# EAGLE schematic psion (EAGLE 9.5.0)

## Sheet 1 of 5
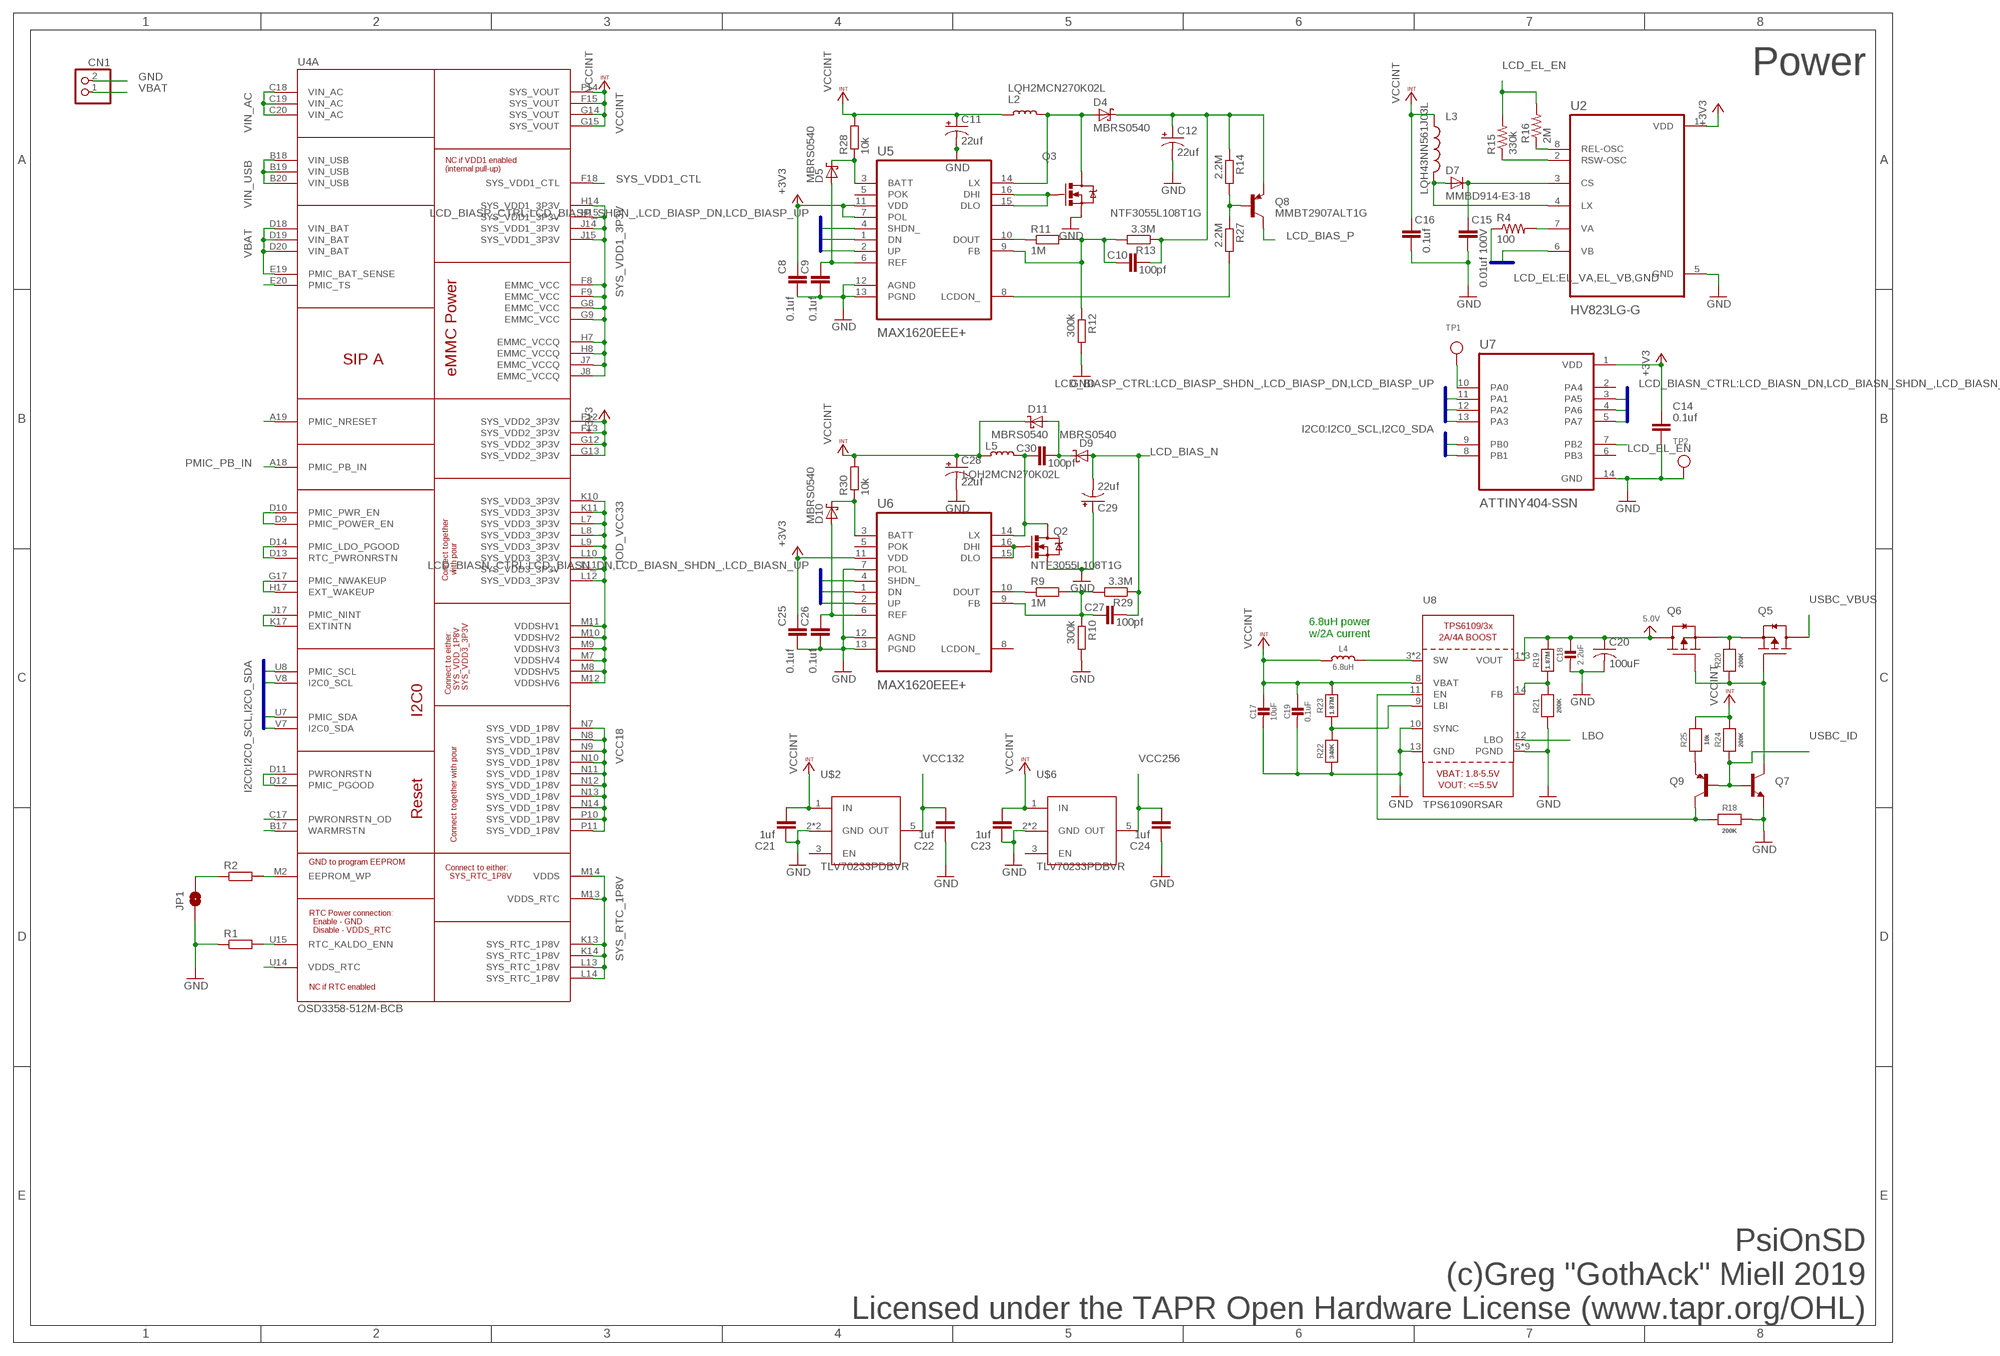
[diagram p0: schematic, sheet 1]

### Parts
C8  0.1uf  CAPACITOR_NPOL-0805  [C805]
C9  0.1uf  CAPACITOR_NPOL-0805  [C805]
C10  100pf  CAPACITOR_NPOL-0805  [C805]
C11  22uf  CPOL-USKEMET_C_2312  [CAPCP6032X280N]
C12  22uf  CPOL-USKEMET_C_2312  [CAPCP6032X280N]
C14  0.1uf  CAPACITOR_NPOL-0805  [C805]
C15  0.01uf 100V  CAPACITOR_NPOL-0805  [C805]
C16  0.1uf  CAPACITOR_NPOL-0805  [C805]
C17  10uF  CAP_CERAMIC0805  [0805]
C18  2.2uF  CAP_CERAMIC0805  [0805]
C19  0.1uF  CAP_CERAMIC0805  [0805]
C20  100uF  C-USC1210  [C1210]
C21  1uf  CAPACITOR_NPOL-0805  [C805]
C22  1uf  CAPACITOR_NPOL-0805  [C805]
C23  1uf  CAPACITOR_NPOL-0805  [C805]
C24  1uf  CAPACITOR_NPOL-0805  [C805]
C25  0.1uf  CAPACITOR_NPOL-0805  [C805]
C26  0.1uf  CAPACITOR_NPOL-0805  [C805]
C27  100pf  CAPACITOR_NPOL-0805  [C805]
C28  22uf  CPOL-USKEMET_C_2312  [CAPCP6032X280N]
C29  22uf  CPOL-USKEMET_C_2312  [CAPCP6032X280N]
C30  100pf  CAPACITOR_NPOL-0805  [C805]
CN1  JST_2PIN-SMT-RA  [JST-PH-2-SMT-RA]
D4  MBRS0540  SCHOTTKY_SOD-123  [SOD3718X135N]
D5  MBRS0540  SCHOTTKY_SOD-123  [SOD3718X135N]
D7  MMBD914-E3-18  DIODE_SOT-23  [SOT95P280X135-3N]
D9  MBRS0540  SCHOTTKY_SOD-123  [SOD3718X135N]
D10  MBRS0540  SCHOTTKY_SOD-123  [SOD3718X135N]
D11  MBRS0540  SCHOTTKY_SOD-123  [SOD3718X135N]
JP1  JUMPER-SMT_2_NO_NO-SILK  [SMT-JUMPER_2_NO_NO-SILK]
L2  LQH2MCN270K02L  INDUCTOR  [INDUCTOR_1007]
L3  LQH43NN561J03L  [IND_LQH43CN1R0M03L]
L4  6.8uH  INDUCTORTDK_VLC5045  [INDUCTOR_5X5MM_TDK_VLC5045]
L5  LQH2MCN270K02L  INDUCTOR  [INDUCTOR_1007]
Q2  NTF3055L108T1G  MOSFET-NCHANNELSMD  [SOT23-3]
Q3  NTF3055L108T1G  MOSFET-NCHANNELSMD  [SOT23-3]
Q5  MOSFET-PCH_SOT-223  [SOT230P700X160-4N]
Q6  MOSFET-PCH_SOT-223  [SOT230P700X160-4N]
Q7  NPN_SOT-323  [SOT65P210X110-3N]
Q8  MMBT2907ALT1G  PNP_SOT-23  [SOT95P280X135-3N]
Q9  PNP_SOT-323  [SOT65P210X110-3N]
R1  R-EU_R0805  [R0805]
R2  R-EU_R0805  [R0805]
R4  100  R-US_M0805  [M0805]
R9  1M  R-EU_R0805  [R0805]
R10  300k  R-EU_R0805  [R0805]
R11  1M  R-EU_R0805  [R0805]
R12  300k  R-EU_R0805  [R0805]
R13  3.3M  R-EU_R0805  [R0805]
R14  2.2M  R-EU_R0805  [R0805]
R15  330k  R-US_M0805  [M0805]
R16  2M  R-US_M0805  [M0805]
R18  200K  RESISTOR0805  [0805]
R19  1.87M  RESISTOR0805  [0805]
R20  200K  RESISTOR0805  [0805]
R21  200K  RESISTOR0805  [0805]
R22  340K  RESISTOR_0805MP  [_0805MP]
R23  1.87M  RESISTOR_0805MP  [_0805MP]
R24  200K  RESISTOR0805  [0805]
R25  10k  RESISTOR0805  [0805]
R27  2.2M  R-EU_R0805  [R0805]
R28  10k  R-EU_R0805  [R0805]
R29  3.3M  R-EU_R0805  [R0805]
R30  10k  R-EU_R0805  [R0805]
TP1  TESTPOINTROUND1MM  [TESTPOINT_ROUND_1MM]
TP2  TESTPOINTROUND1MM  [TESTPOINT_ROUND_1MM]
U2  HV823LG-G  [SOIC127P600X175-8N]
U4  OSD3358-512M-BCB  [OSD335X-BGA-400]
U5  MAX1620EEE+  [SOP63P602X175-16N]
U6  MAX1620EEE+  [SOP63P602X175-16N]
U7  ATTINY404-SSN  [SOIC127P600X175-14N]
U8  TPS61090RSAR  VREG_TPS6103X  [PVQFN-16]
U$2  TLV70233PDBVR  [SOT23-5]
U$6  TLV70233PDBVR  [SOT23-5]

### Nets
5.0V: C18.1 C20.1 Q6.4(D) R19.2 U8.1(VOUT) U8.15(VOUT) U8.16(VOUT)
+3V3 [power]: C8.1 C14.1 C25.1 U2.1(VDD) U4.F12(A:SYS_VDD2_3P3V) U4.F13(A:SYS_VDD2_3P3V) U4.G12(A:SYS_VDD2_3P3V) U4.G13(A:SYS_VDD2_3P3V) U5.7(POL) U5.11(VDD) U6.11(VDD) U7.1(VDD) ; also sheet 2,3
BOOST_EN: Q9.3(C) R18.1 U8.11(EN)
EL_VA [power]: R4.1 ; also sheet 3
EL_VA_PRE [power]: R4.2 U2.7(VA)
EL_VB [power]: U2.6(VB) ; also sheet 3
GND [power]: C8.2 C9.2 C11.N(-) C12.N(-) C14.2 C15.2 C16.2 C17.2 C18.2 C19.2 C20.2 C21.1 C22.1 C23.1 C24.1 C25.2 C26.2 C28.N(-) C29.P(+) CN1.2 JP1.1 Q2.2(S) Q3.2(S) Q7.2(E) R1.1 R10.2 R12.2 R18.2 R21.1 R22.1 TP2.P$1 U2.5(GND) U5.12(AGND) U5.13(PGND) U6.7(POL) U6.12(AGND) U6.13(PGND) U7.14(GND) U8.5(PGND) U8.6(PGND) U8.7(PGND) U8.10(SYNC) U8.13(GND) U8.P$18(PGND) U8.P$19(PGND) U8.P$20(PGND) U8.P$21(PGND) U8.P$22(PGND) U8.THERMAL(PGND) U$2.2(GND) U$2.4(GND) U$6.2(GND) U$6.4(GND) ; also sheet 2,3,4
I2C0_SCL [data]: U4.U8(A:PMIC_SCL) U4.V8(A:I2C0_SCL) U7.9(PB0) ; also sheet 2
I2C0_SDA [data]: U4.U7(A:PMIC_SDA) U4.V7(A:I2C0_SDA) U7.8(PB1) ; also sheet 2
IOD_VCC33 [power]: U4.K10(A:SYS_VDD3_3P3V) U4.K11(A:SYS_VDD3_3P3V) U4.L7(A:SYS_VDD3_3P3V) U4.L8(A:SYS_VDD3_3P3V) U4.L9(A:SYS_VDD3_3P3V) U4.L10(A:SYS_VDD3_3P3V) U4.L11(A:SYS_VDD3_3P3V) U4.L12(A:SYS_VDD3_3P3V) U4.M7(A:VDDSHV4) U4.M8(A:VDDSHV5) U4.M9(A:VDDSHV3) U4.M10(A:VDDSHV2) U4.M11(A:VDDSHV1) U4.M12(A:VDDSHV6)
LBO: U8.12(LBO)
LCD_BIAS_N [power]: C27.2 C29.N(-) D9.A R29.1 ; also sheet 3
LCD_BIAS_N_P1 [power]: C30.1 L5.P$2 Q2.3(D) U6.14(LX)
LCD_BIAS_N_P2 [power]: C30.2 D9.K D11.A
LCD_BIAS_P [power]: Q8.3(C) ; also sheet 3
LCD_BIAS_P_P1 [power]: D4.A L2.P$2 Q3.3(D) U5.14(LX)
LCD_BIAS_P_P2 [power]: C10.2 C12.P(+) D4.K Q8.2(E) R13.1 R14.1
LCD_BIASN_SHDN_: U6.4(SHDN_) U7.5(PA7)
LCD_BIASN_UP: U6.2(UP) U7.4(PA6)
LCD_BIASND_N: U6.1(DN) U7.3(PA5)
LCD_BIASP_SHDN_: U5.4(SHDN_) U7.13(PA3)
LCD_BIASP_UP: U5.2(UP) U7.11(PA1)
LCD_BIASPD_N: U5.1(DN) U7.12(PA2)
LCD_EL_EN: R15.2 R16.2 U7.7(PB2)
N$1: D7.1(A) L3.2 U2.4(LX)
N$3: C15.1 D7.3(K) U2.3(CS)
N$5: R2.2 U4.M2(A:EEPROM_WP)
N$7: U4.D9(A:PMIC_POWER_EN) U4.D10(A:PMIC_PWR_EN)
N$8: U4.D13(A:RTC_PWRONRSTN) U4.D14(A:PMIC_LDO_PGOOD)
N$9: U4.J17(A:PMIC_NINT) U4.K17(A:EXTINTN)
N$10: U4.G17(A:PMIC_NWAKEUP) U4.H17(A:EXT_WAKEUP)
N$11: U4.D11(A:PWRONRSTN) U4.D12(A:PMIC_PGOOD)
N$12: JP1.2 R2.1
N$16: Q3.1(G) U5.15(DLO) U5.16(DHI)
N$23: Q2.1(G) U6.15(DLO) U6.16(DHI)
N$25: R11.1 U5.10(DOUT)
N$26: C10.1 R11.2 R12.1 R13.2 U5.9(FB)
N$28: Q8.1(B) R14.2 R27.1
N$29: TP1.P$1 U7.10(PA0)
N$32: R27.2 U5.8(LCDON_)
N$33: R15.1 U2.2(RSW-OSC)
N$34: R16.1 U2.8(REL-OSC)
N$37: R22.2 R23.1 U8.9(LBI)
N$39: R19.1 R21.2 U8.14(FB)
N$42: Q5.1(G) Q6.1(G) Q7.3(C) R20.1
N$44: Q9.2(E) R25.1
N$45: D5.K R28.1 U5.3(BATT)
N$46: C9.1 D5.A U5.6(REF)
N$47: R9.1 U6.10(DOUT)
N$48: C27.1 R9.2 R10.1 R29.2 U6.9(FB)
N$49: D10.K R30.1 U6.3(BATT)
N$50: C26.1 D10.A U6.6(REF)
PMIC_NRESET: U4.A19(A:PMIC_NRESET)
PMIC_PB_IN [data]: U4.A18(A:PMIC_PB_IN) ; also sheet 2
PMIC_TS: U4.E20(A:PMIC_TS)
PWRONRSTN_OD: U4.C17(A:PWRONRSTN_OD)
ROPU: R1.2 U4.U15(A:RTC_KALDO_ENN)
SYS_RTC_1P8V [power]: U4.K13(A:SYS_RTC_1P8V) U4.K14(A:SYS_RTC_1P8V) U4.L13(A:SYS_RTC_1P8V) U4.L14(A:SYS_RTC_1P8V) U4.M13(A:VDDS_RTC) U4.M14(A:VDDS)
SYS_VDD1_3P3V [power]: U4.F8(A:EMMC_VCC) U4.F9(A:EMMC_VCC) U4.G8(A:EMMC_VCC) U4.G9(A:EMMC_VCC) U4.H7(A:EMMC_VCCQ) U4.H8(A:EMMC_VCCQ) U4.H14(A:SYS_VDD1_3P3V) U4.H15(A:SYS_VDD1_3P3V) U4.J7(A:EMMC_VCCQ) U4.J8(A:EMMC_VCCQ) U4.J14(A:SYS_VDD1_3P3V) U4.J15(A:SYS_VDD1_3P3V)
SYS_VDD1_CTL: U4.F18(A:SYS_VDD1_CTL)
USBC_ID: Q7.1(B) Q9.1(B) R24.1 ; also sheet 2
USBC_IND_SW [power]: L4.P$2 U8.3(SW) U8.4(SW)
USBC_VBUS [power]: Q5.4(D) ; also sheet 2
USBC_VBUS_SW [power]: Q5.3(S) Q6.3(S) R20.2
VBAT [power]: CN1.1 U4.D18(A:VIN_BAT) U4.D19(A:VIN_BAT) U4.D20(A:VIN_BAT) U4.E19(A:PMIC_BAT_SENSE) ; also sheet 2
VCC18 [power]: U4.N7(A:SYS_VDD_1P8V) U4.N8(A:SYS_VDD_1P8V) U4.N9(A:SYS_VDD_1P8V) U4.N10(A:SYS_VDD_1P8V) U4.N11(A:SYS_VDD_1P8V) U4.N12(A:SYS_VDD_1P8V) U4.N13(A:SYS_VDD_1P8V) U4.N14(A:SYS_VDD_1P8V) U4.P10(A:SYS_VDD_1P8V) U4.P11(A:SYS_VDD_1P8V)
VCC132 [power]: C22.2 U$2.5(OUT) ; also sheet 3
VCC256 [power]: C24.2 U$6.5(OUT) ; also sheet 3
VCCINT [power]: C11.P(+) C16.1 C17.1 C19.1 C21.2 C23.2 C28.P(+) D11.K L2.P$1 L3.1 L4.P$1 L5.P$1 R23.2 R24.2 R25.2 R28.2 R30.2 U4.F14(A:SYS_VOUT) U4.F15(A:SYS_VOUT) U4.G14(A:SYS_VOUT) U4.G15(A:SYS_VOUT) U8.8(VBAT) U$2.1(IN) U$6.1(IN) ; also sheet 2
VDDS_RTC@2: U4.U14(A:VDDS_RTC)
VIN_AC [power]: U4.C18(A:VIN_AC) U4.C19(A:VIN_AC) U4.C20(A:VIN_AC)
VIN_USB [power]: U4.B18(A:VIN_USB) U4.B19(A:VIN_USB) U4.B20(A:VIN_USB)
WARMRSTN: U4.B17(A:WARMRSTN)
Unconnected: U5.5(POK) U6.5(POK) U6.8(LCDON_) U7.2(PA4) U7.6(PB3) U$2.3(EN) U$6.3(EN)

### Buses
I2C0:I2C0_SCL,I2C0_SDA
LCD_BIASP_CTRL:LCD_BIASP_SHDN_,LCD_BIASP_DN,LCD_BIASP_UP
LCD_BIASN_CTRL:LCD_BIASN_DN,LCD_BIASN_SHDN_,LCD_BIASN_UP
LCD_EL:EL_VA,EL_VB,GND

### Notes on the sheet
- Power
- 6.8uH power
  w/2A current
- PsiOnSD
  (c)Greg "GothAck" Miell 2019
  Licensed under the TAPR Open Hardware License (www.tapr.org/OHL)

## Sheet 2 of 5
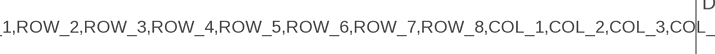
[diagram p1: schematic, sheet 2, part 1 of 2]
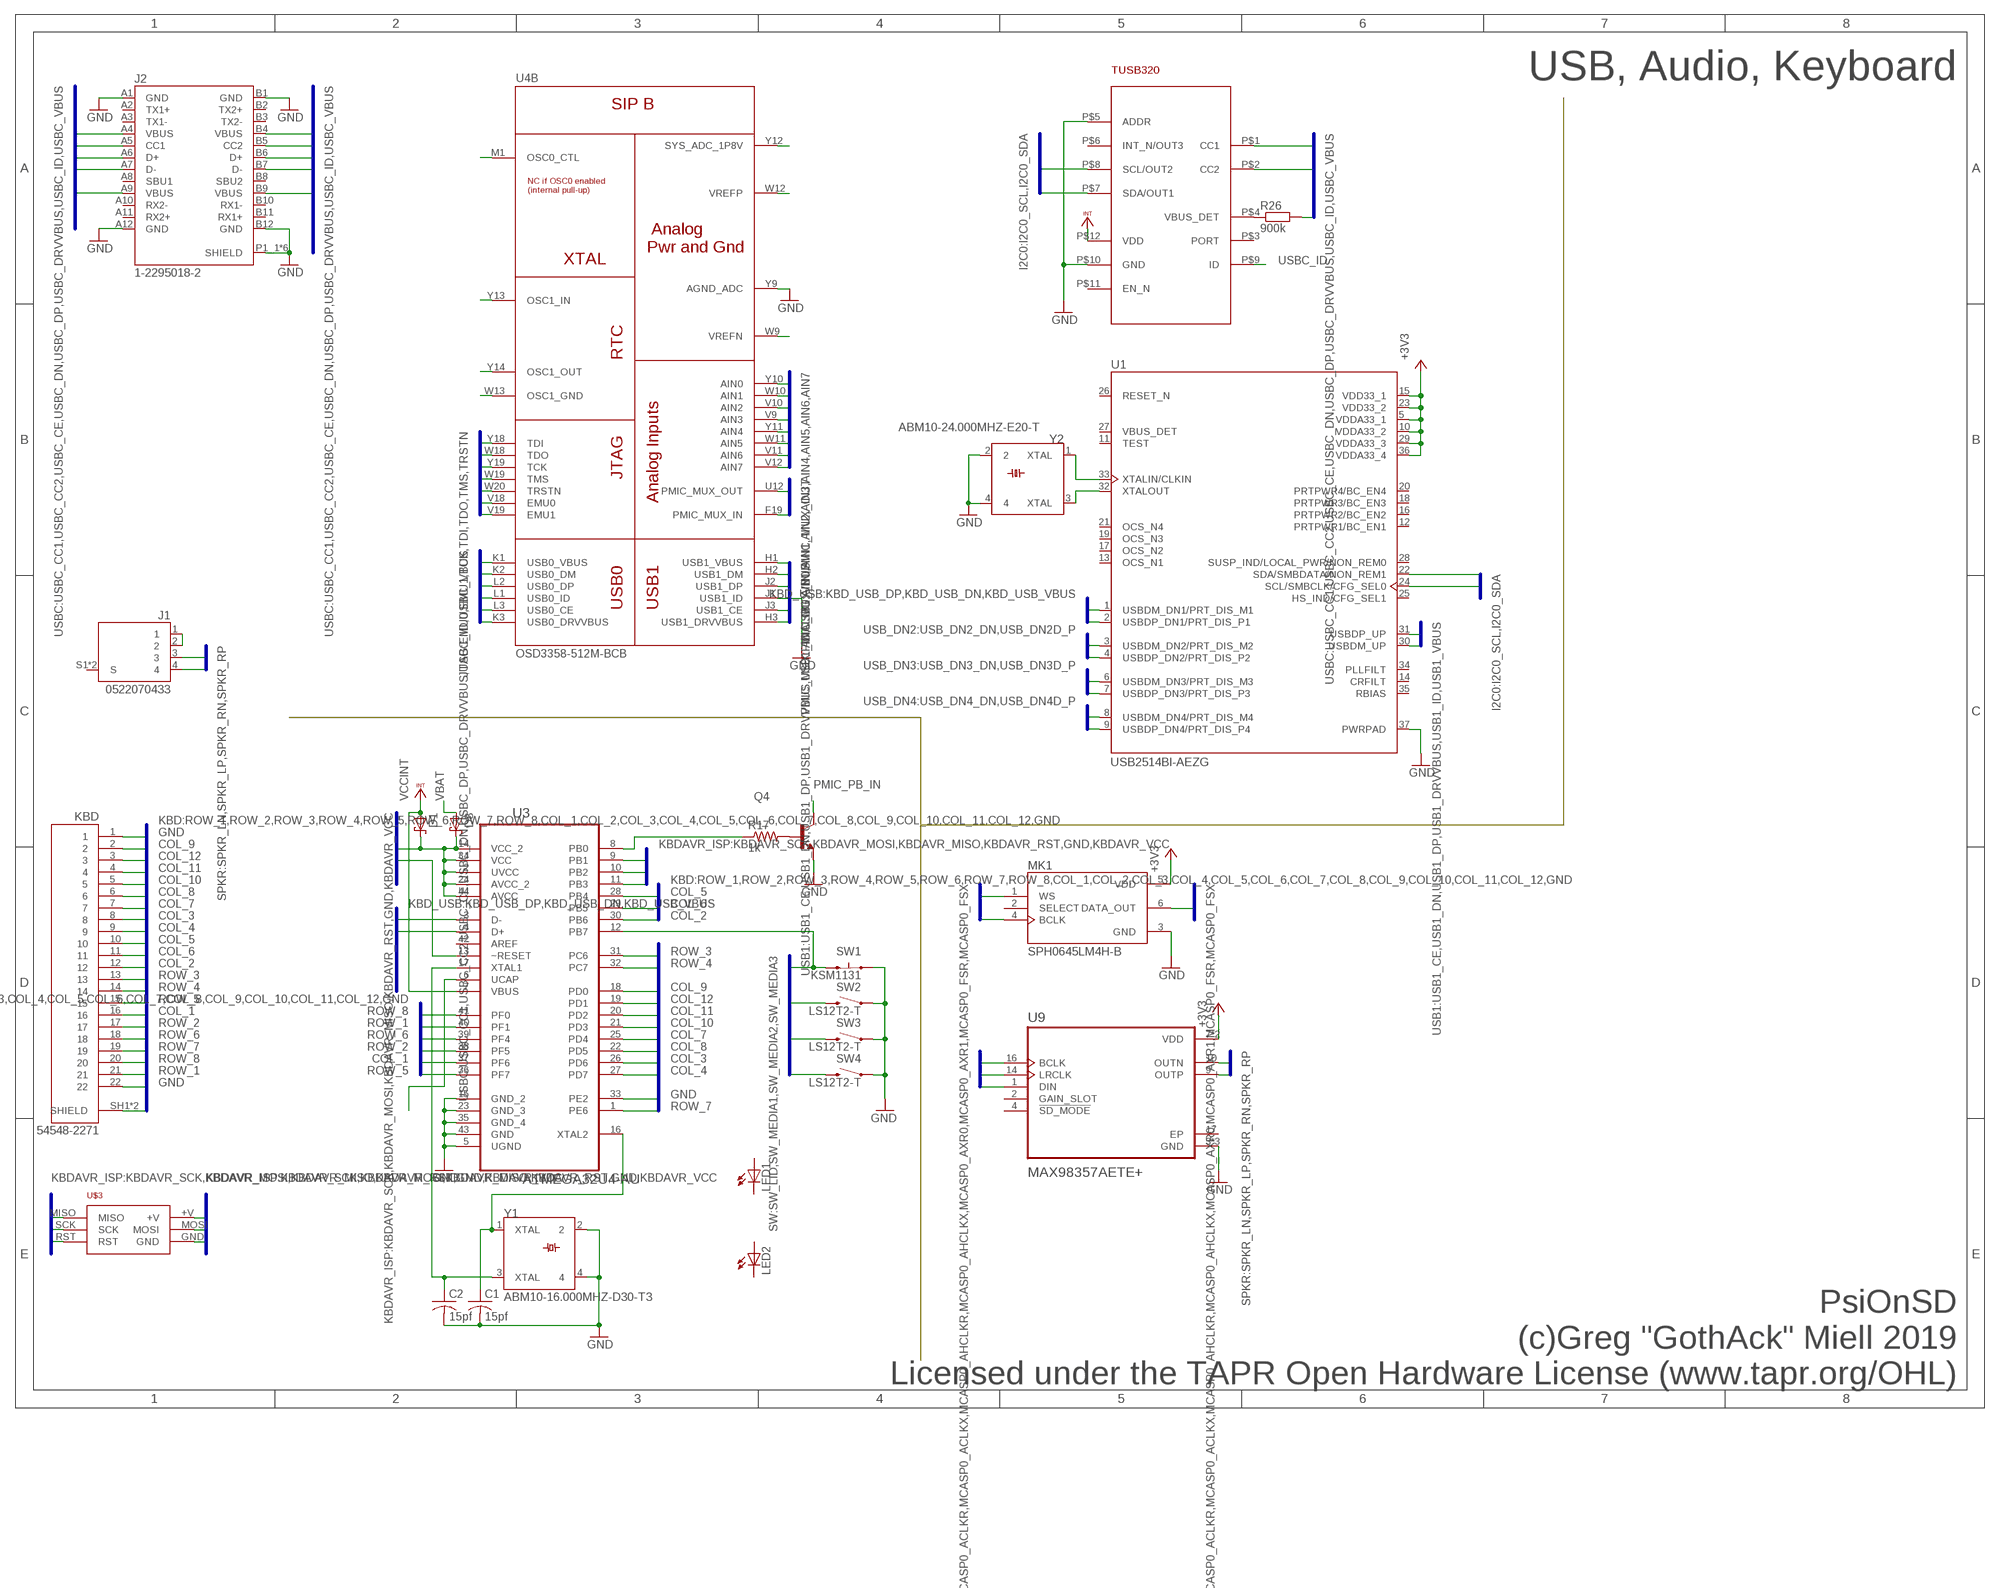
[diagram p2: schematic, sheet 2, part 2 of 2]

### Parts
C1  15pf  C-USC0402  [C0402]
C2  15pf  C-USC0402  [C0402]
D1  SCHOTTKY_SOD-123  [SOD3718X135N]
D8  SCHOTTKY_SOD-123  [SOD3718X135N]
J1  0522070433  [MOLEX_0522070433]
J2  1-2295018-2  [TE_1-2295018-2]
KBD  54548-2271  [MOLEX_54548-2271]
LED1  LEDCHIP-LED0805  [CHIP-LED0805]
LED2  LEDCHIP-LED0805  [CHIP-LED0805]
MK1  SPH0645LM4H-B  [MIC_SPH0645LM4H-B]
Q4  NPN_SOT-323  [SOT65P210X110-3N]
R17  1k  R-US_M0805  [M0805]
R26  900k  R-EU_R0805  [R0805]
SW1  KSM1131  [KSM1131]
SW2  LS12T2-T  [LS12T2-T]
SW3  LS12T2-T  [LS12T2-T]
SW4  LS12T2-T  [LS12T2-T]
U1  USB2514BI-AEZG  [QFN50P600X600X100-37N]
U3  ATMEGA32U4-AU  [QFP80P1200X1200X120-44N]
U9  MAX98357AETE+  [QFN50P300X300X80-17N]
U$3  1.27MM-ICSP  [1.27MM-ICSP]
U$4  TUSB320XQFN  [X2QFN]
Y1  ABM10-16.000MHZ-D30-T3  [XTAL250X200X50]
Y2  ABM10-24.000MHZ-E20-T  ABM10-16.000MHZ-D30-T3  [XTAL250X200X50]

### Nets
+3V3 [power]: MK1.5(VDD) U1.5(VDDA33_1) U1.10(VDDA33_2) U1.15(VDD33_1) U1.23(VDD33_2) U1.29(VDDA33_3) U1.36(VDDA33_4) U9.7(VDD) U9.8(VDD) ; also sheet 1,3
AIN0: U4.Y10(B:AIN0)
AIN1: U4.W10(B:AIN1)
AIN2: U4.V10(B:AIN2)
AIN3: U4.V9(B:AIN3)
AIN4: U4.Y11(B:AIN4)
AIN5: U4.W11(B:AIN5)
AIN6: U4.V11(B:AIN6)
AIN7: U4.V12(B:AIN7)
COL_1 [data]: KBD.16 U3.37(PF6)
COL_2 [data]: KBD.12 U3.30(PB6)
COL_3 [data]: KBD.8 U3.26(PD6)
COL_4 [data]: KBD.9 U3.27(PD7)
COL_5 [data]: KBD.10 U3.28(PB4)
COL_6 [data]: KBD.11 U3.29(PB5)
COL_7 [data]: KBD.7 U3.25(PD4)
COL_8 [data]: KBD.6 U3.22(PD5)
COL_9 [data]: KBD.2 U3.18(PD0)
COL_10 [data]: KBD.5 U3.21(PD3)
COL_11 [data]: KBD.4 U3.20(PD2)
COL_12 [data]: KBD.3 U3.19(PD1)
EMU0: U4.V18(B:EMU0)
EMU1: U4.V19(B:EMU1)
GND [power]: C1.2 C2.2 J2.A1(GND) J2.A12(GND) J2.B1(GND) J2.B12(GND) J2.P1_1(SHIELD) J2.P1_2(SHIELD) J2.P2_1(SHIELD) J2.P2_2(SHIELD) J2.P4(SHIELD) J2.P5(SHIELD) KBD.1 KBD.22 KBD.SH1(SHIELD) KBD.SH2(SHIELD) MK1.3(GND) Q4.2(E) SW1.1 SW2.1 SW3.1 SW4.1 U1.37(PWRPAD) U3.5(UGND) U3.15(GND_2) U3.23(GND_3) U3.33(PE2) U3.35(GND_4) U3.43(GND) U4.J1(B:USB1_ID) U4.Y9(B:AGND_ADC) U9.3(GND) U9.11(GND) U9.15(GND) U$3.GND U$4.P$5(ADDR) U$4.P$10(GND) Y1.2 Y1.4 Y2.2 Y2.4 ; also sheet 1,3,4
I2C0_SCL [data]: U1.24(SCL/SMBCLK/CFG_SEL0) U$4.P$8(SCL/OUT2) ; also sheet 1
I2C0_SDA [data]: U1.22(SDA/SMBDATA/NON_REM1) U$4.P$7(SDA/OUT1) ; also sheet 1
KBD_USBD_N [data_usb]: U1.1(USBDM_DN1/PRT_DIS_M1) U3.3(D-)
KBD_USBD_P [data_usb]: U1.2(USBDP_DN1/PRT_DIS_P1) U3.4(D+)
KBDAVR_MISO [data]: U3.11(PB3) U$3.MISO
KBDAVR_MOSI [data]: U3.10(PB2) U$3.MOSI
KBDAVR_RST [data]: U3.13(~RESET) U$3.RST
KBDAVR_SCK [data]: U3.9(PB1) U$3.SCK
KBDAVR_VCC [power]: D1.K D8.K U3.2(UVCC) U3.14(VCC_2) U3.24(AVCC_2) U3.34(VCC) U3.44(AVCC) U$3.+V
MCASP0_ACLKR: MK1.4(BCLK) ; also sheet 3
MCASP0_ACLKX: U9.16(BCLK) ; also sheet 3
MCASP0_AXR0: U9.1(DIN) ; also sheet 3
MCASP0_AXR1: MK1.6(DATA_OUT) ; also sheet 3
MCASP0_FSR: MK1.1(WS) ; also sheet 3
MCASP0_FSX: U9.14(LRCLK) ; also sheet 3
N$4: U1.33(XTALIN/CLKIN) Y2.1(XTAL)
N$13 [data]: C1.1 U3.16(XTAL2) Y1.1(XTAL)
N$14 [data]: C2.1 U3.17(XTAL1) Y1.3(XTAL)
N$15: U1.32(XTALOUT) Y2.3(XTAL)
N$20: J1.1 J1.2
N$21: U3.6(UCAP)
N$38 [data]: R17.1 U3.8(PB0)
N$40: Q4.1(B) R17.2
N$43: R26.1 U$4.P$4(VBUS_DET)
OSC0_CTL: U4.M1(B:OSC0_CTL)
OSC1_GND: U4.W13(B:OSC1_GND)
OSC1_IN: U4.Y13(B:OSC1_IN)
OSC1_OUT: U4.Y14(B:OSC1_OUT)
PMIC_MUX_IN: U4.F19(B:PMIC_MUX_IN)
PMIC_MUX_OUT: U4.U12(B:PMIC_MUX_OUT)
PMIC_PB_IN [data]: Q4.3(C) ; also sheet 1
ROW_1 [data]: KBD.21 U3.40(PF1)
ROW_2 [data]: KBD.17 U3.38(PF5)
ROW_3 [data]: KBD.13 U3.31(PC6)
ROW_4 [data]: KBD.14 U3.32(PC7)
ROW_5 [data]: KBD.15 U3.36(PF7)
ROW_6 [data]: KBD.18 U3.39(PF4)
ROW_7 [data]: KBD.19 U3.1(PE6)
ROW_8 [data]: KBD.20 U3.41(PF0)
SPKR_LN: J1.3 U9.10(OUTN)
SPKR_LP: J1.4 U9.9(OUTP)
SW_LID: SW1.2 U3.12(PB7)
SW_MEDIA1: SW2.2
SW_MEDIA2: SW3.2
SW_MEDIA3: SW4.2
SYS_ADC_1P8V: U4.Y12(B:SYS_ADC_1P8V)
TCK: U4.Y19(B:TCK)
TDI: U4.Y18(B:TDI)
TDO: U4.W18(B:TDO)
TMS: U4.W19(B:TMS)
TRSTN: U4.W20(B:TRSTN)
USB1_CE: U4.J3(B:USB1_CE)
USB1_DRVVBUS: U4.H3(B:USB1_DRVVBUS)
USB1_VBUS: U4.H1(B:USB1_VBUS)
USB1D_N [data_usb]: U1.30(USBDM_UP) U4.H2(B:USB1_DM)
USB1D_P [data_usb]: U1.31(USBDP_UP) U4.J2(B:USB1_DP)
USB_DN2D_N [data_usb]: U1.3(USBDM_DN2/PRT_DIS_M2)
USB_DN2D_P [data_usb]: U1.4(USBDP_DN2/PRT_DIS_P2)
USB_DN3D_N [data_usb]: U1.6(USBDM_DN3/PRT_DIS_M3)
USB_DN3D_P [data_usb]: U1.7(USBDP_DN3/PRT_DIS_P3)
USB_DN4D_N [data_usb]: U1.8(USBDM_DN4/PRT_DIS_M4)
USB_DN4D_P [data_usb]: U1.9(USBDP_DN4/PRT_DIS_P4)
USBC_CC1 [data]: J2.A5(CC1) U$4.P$1(CC1)
USBC_CC2 [data]: J2.B5(CC2) U$4.P$2(CC2)
USBC_CE: U4.L3(B:USB0_CE)
USBC_DRVVBUS: U4.K3(B:USB0_DRVVBUS)
USBC_ID: U4.L1(B:USB0_ID) U$4.P$9(ID) ; also sheet 1
USBC_VBUS [power]: J2.A4(VBUS) J2.A9(VBUS) J2.B4(VBUS) J2.B9(VBUS) R26.2 U4.K1(B:USB0_VBUS) ; also sheet 1
USBCD_N [data_usb]: J2.A7(D-) J2.B7(D-) U4.K2(B:USB0_DM)
USBCD_P [data_usb]: J2.A6(D+) J2.B6(D+) U4.L2(B:USB0_DP)
VBAT [power]: D8.A ; also sheet 1
VCCINT [power]: D1.A U3.7(VBUS) U$4.P$12(VDD) ; also sheet 1
VREFN: U4.W9(B:VREFN)
VREFP: U4.W12(B:VREFP)
Unconnected: J2.A2(TX1+) J2.A3(TX1-) J2.A8(SBU1) J2.A10(RX2-) J2.A11(RX2+) J2.B2(TX2+) J2.B3(TX2-) J2.B8(SBU2) J2.B10(RX1-) J2.B11(RX1+) LED1.A LED1.C LED2.A LED2.C MK1.2(SELECT) U1.11(TEST) U1.12(PRTPWR1/BC_EN1) U1.13(OCS_N1) U1.14(CRFILT) U1.16(PRTPWR2/BC_EN2) U1.17(OCS_N2) U1.18(PRTPWR3/BC_EN3) U1.19(OCS_N3) U1.20(PRTPWR4/BC_EN4) U1.21(OCS_N4) U1.25(HS_IND/CFG_SEL1) U1.26(RESET_N) U1.27(VBUS_DET) U1.28(SUSP_IND/LOCAL_PWR/NON_REM0) U1.34(PLLFILT) U1.35(RBIAS) U3.42(AREF) U9.2(GAIN_SLOT) U9.4(!SD_MODE) U$4.P$3(PORT) U$4.P$6(INT_N/OUT3) U$4.P$11(EN_N)

### Buses
KBD:ROW_1,ROW_2,ROW_3,ROW_4,ROW_5,ROW_6,ROW_7,ROW_8,COL_1,COL_2,COL_3,COL_4,COL_5,COL_6,COL_7,COL_8,COL_9,COL_10,COL_11,COL_12,GND
KBD_USB:KBD_USB_DP,KBD_USB_DN,KBD_USB_VBUS
KBDAVR_ISP:KBDAVR_SCK,KBDAVR_MOSI,KBDAVR_MISO,KBDAVR_RST,GND,KBDAVR_VCC
SW:SW_LID,SW_MEDIA1,SW_MEDIA2,SW_MEDIA3
USBC:USBC_CC1,USBC_CC2,USBC_CE,USBC_DN,USBC_DP,USBC_DRVVBUS,USBC_ID,USBC_VBUS
I2C0:I2C0_SCL,I2C0_SDA
USB1:USB1_CE,USB1_DN,USB1_DP,USB1_DRVVBUS,USB1_ID,USB1_VBUS
ANALOG:AIN0,AIN1,AIN2,AIN3,AIN4,AIN5,AIN6,AIN7
JTAG:EMU0,EMU1,TCK,TDI,TDO,TMS,TRSTN
PMIC_MUX:PMIC_MUX_IN,PMIC_MUX_OUT
USB_DN2:USB_DN2_DN,USB_DN2D_P
USB_DN3:USB_DN3_DN,USB_DN3D_P
USB_DN4:USB_DN4_DN,USB_DN4D_P
MCASP0:MCASP0_ACLKR,MCASP0_ACLKX,MCASP0_AHCLKR,MCASP0_AHCLKX,MCASP0_AXR0,MCASP0_AXR1,MCASP0_FSR,MCASP0_FSX
SPKR:SPKR_LN,SPKR_LP,SPKR_RN,SPKR_RP

### Notes on the sheet
- USB, Audio, Keyboard
- PsiOnSD
  (c)Greg "GothAck" Miell 2019
  Licensed under the TAPR Open Hardware License (www.tapr.org/OHL)

## Sheet 3 of 5
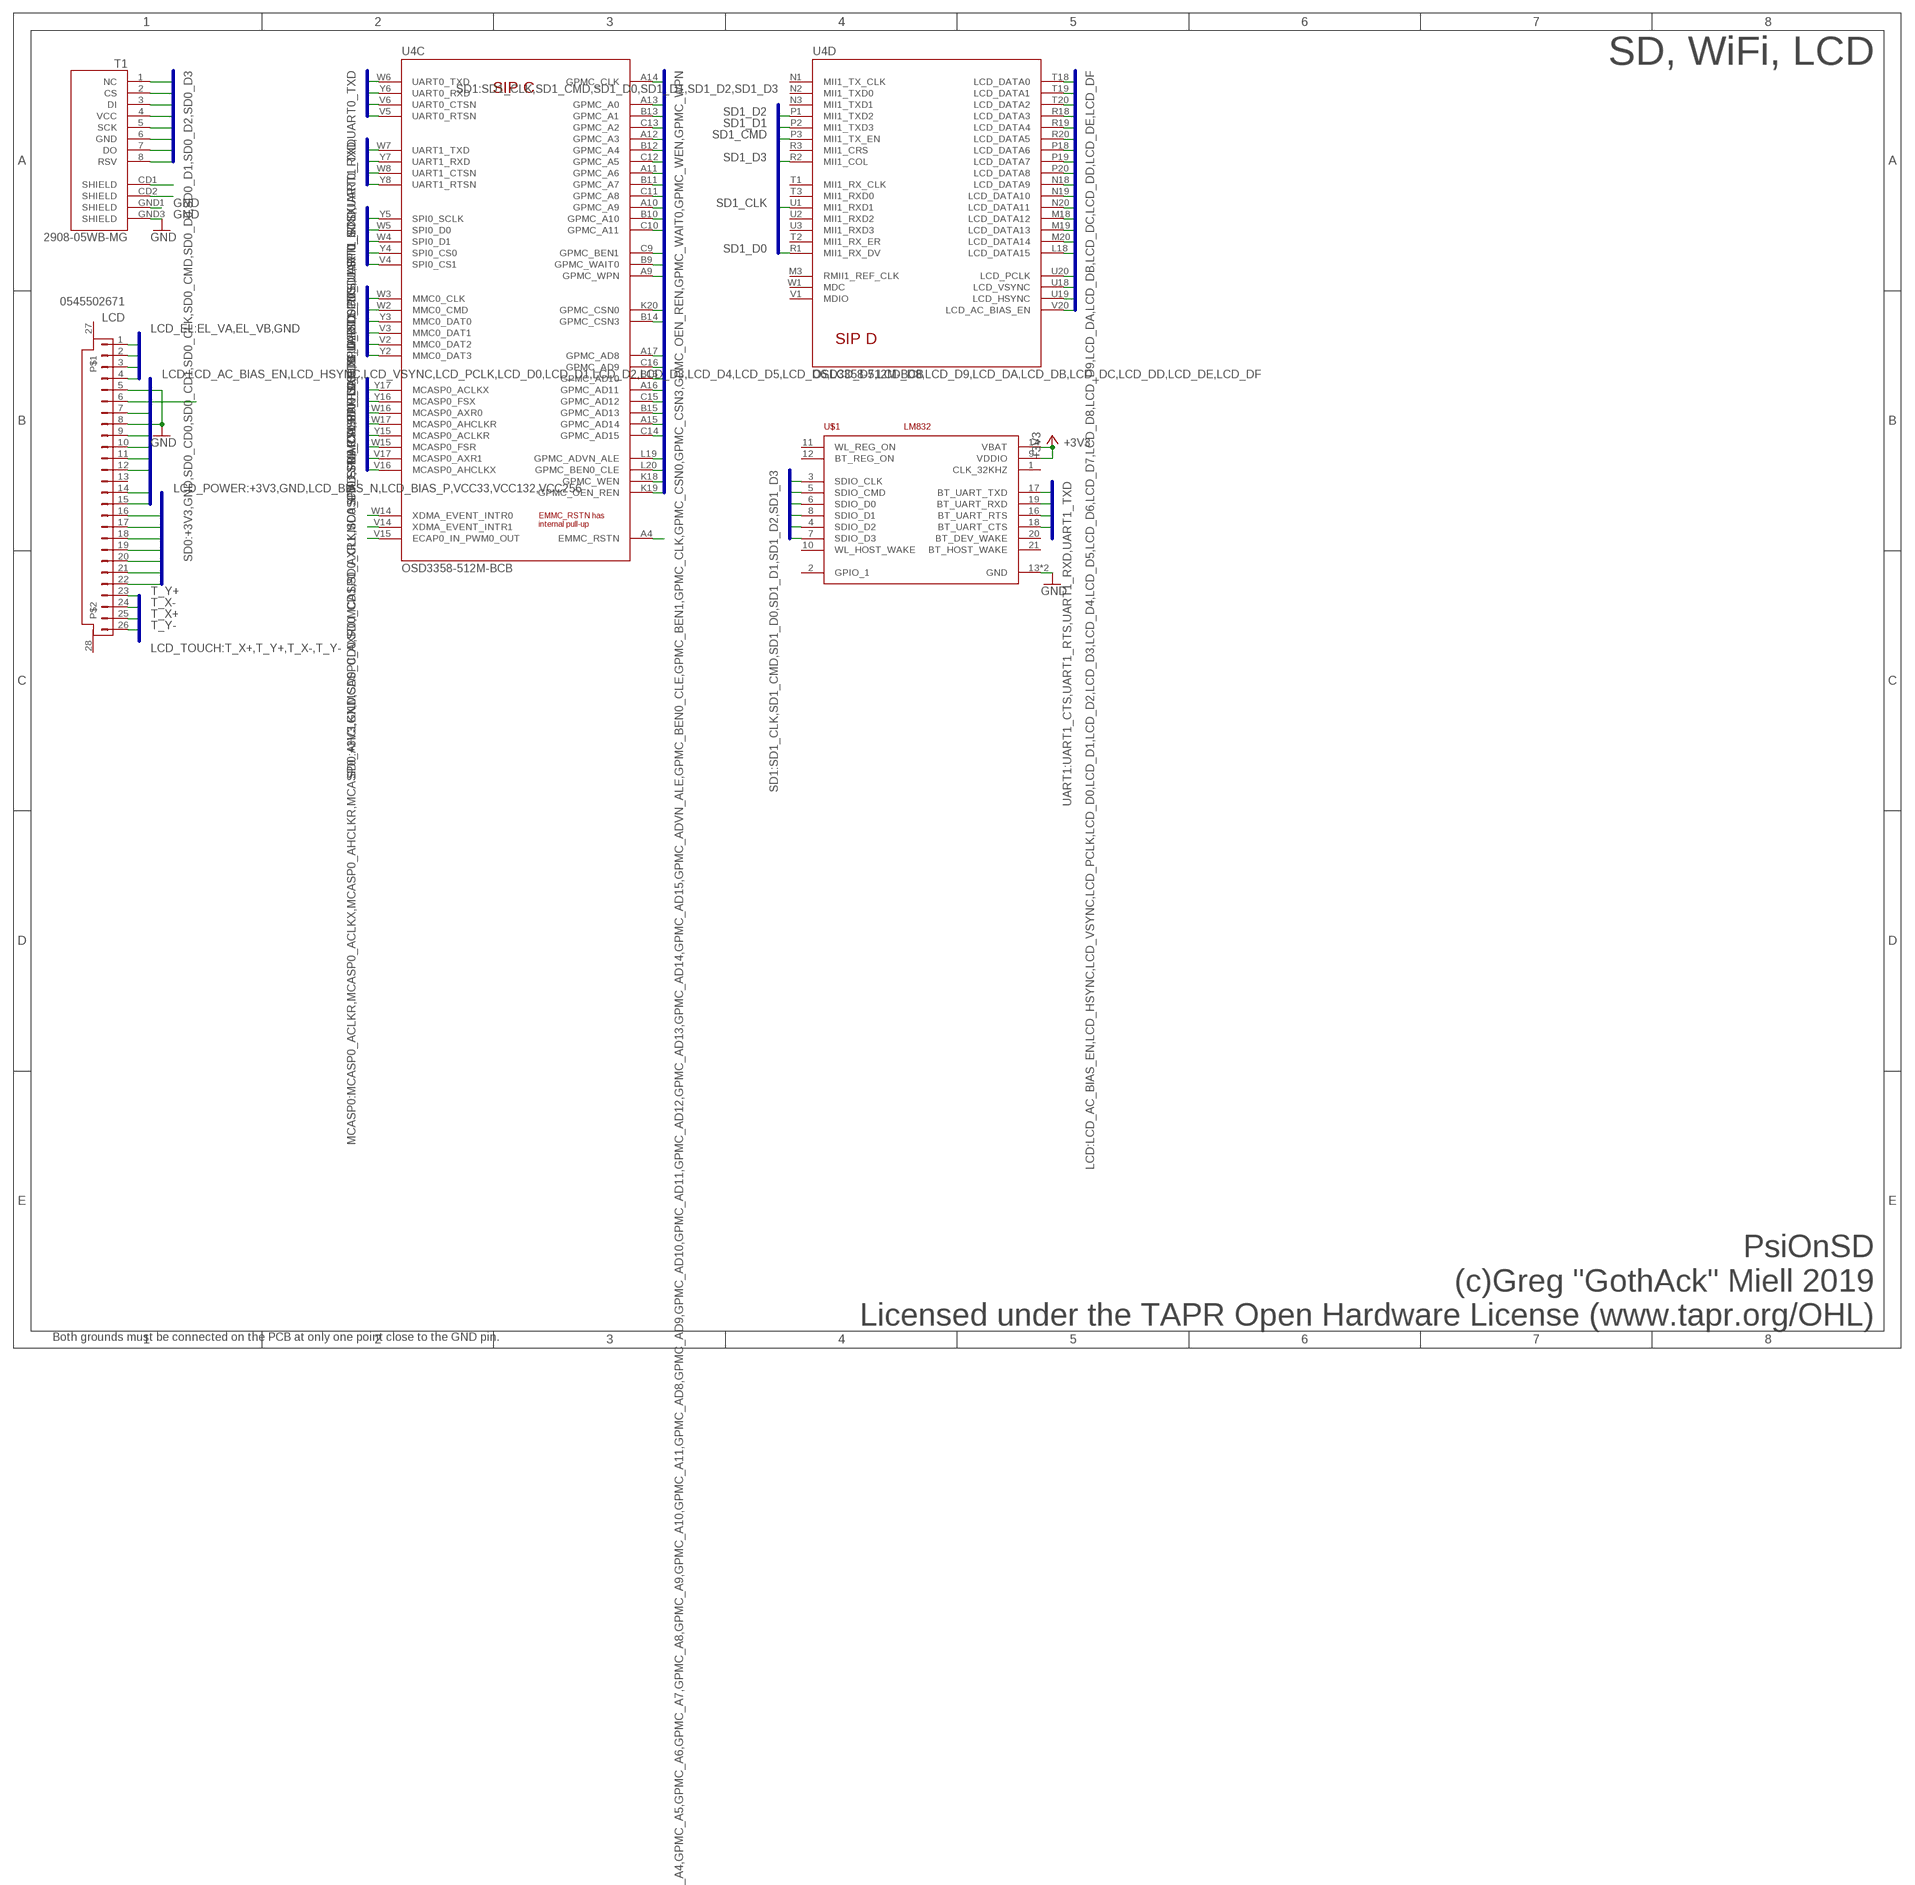
[diagram p3: schematic, sheet 3]

### Parts
LCD  0545502671  [0545502671]
T1  2908-05WB-MG  [MICRO-SD-SOCKET-PP]
U$1  LM832EMBEDDED  [LM832SMT_EMB]

### Nets
+3V3 [power]: LCD.16 LCD.21 T1.4(VCC) U$1.9(VDDIO) U$1.14(VBAT) ; also sheet 1,2
ECAP0_IN_PWM0_OUT: U4.V15(C:ECAP0_IN_PWM0_OUT)
EL_VA [power]: LCD.3 ; also sheet 1
EL_VB [power]: LCD.1 ; also sheet 1
EMMC_RSTN: U4.A4(C:EMMC_RSTN)
GND [power]: LCD.2 LCD.4 LCD.5 LCD.8 LCD.22 T1.6(GND) T1.GND1(SHIELD) T1.GND3(SHIELD) U$1.13(GND) U$1.15(GND) ; also sheet 1,2,4
GPMC_A0: U4.A13(C:GPMC_A0)
GPMC_A1: U4.B13(C:GPMC_A1)
GPMC_A2: U4.C13(C:GPMC_A2)
GPMC_A3: U4.A12(C:GPMC_A3)
GPMC_A4: U4.B12(C:GPMC_A4)
GPMC_A5: U4.C12(C:GPMC_A5)
GPMC_A6: U4.A11(C:GPMC_A6)
GPMC_A7: U4.B11(C:GPMC_A7)
GPMC_A8: U4.C11(C:GPMC_A8)
GPMC_A9: U4.A10(C:GPMC_A9)
GPMC_A10: U4.B10(C:GPMC_A10)
GPMC_A11: U4.C10(C:GPMC_A11)
GPMC_AD8: U4.A17(C:GPMC_AD8)
GPMC_AD9: U4.C16(C:GPMC_AD9)
GPMC_AD10: U4.B16(C:GPMC_AD10)
GPMC_AD11: U4.A16(C:GPMC_AD11)
GPMC_AD12: U4.C15(C:GPMC_AD12)
GPMC_AD13: U4.B15(C:GPMC_AD13)
GPMC_AD14: U4.A15(C:GPMC_AD14)
GPMC_AD15: U4.C14(C:GPMC_AD15)
GPMC_ADVN_ALE: U4.L19(C:GPMC_ADVN_ALE)
GPMC_BEN0_CLE: U4.L20(C:GPMC_BEN0_CLE)
GPMC_BEN1: U4.C9(C:GPMC_BEN1)
GPMC_CLK: U4.A14(C:GPMC_CLK)
GPMC_CSN0: U4.K20(C:GPMC_CSN0)
GPMC_CSN3: U4.B14(C:GPMC_CSN3)
GPMC_OEN_REN: U4.K19(C:GPMC_OEN_REN)
GPMC_WAIT0: U4.B9(C:GPMC_WAIT0)
GPMC_WEN: U4.K18(C:GPMC_WEN)
GPMC_WPN: U4.A9(C:GPMC_WPN)
LCD_AC_BIAS_EN [data_lcd]: U4.V20(D:LCD_AC_BIAS_EN)
LCD_BIAS_N [power]: LCD.19 ; also sheet 1
LCD_BIAS_P [power]: LCD.20 ; also sheet 1
LCD_D0 [data_lcd]: LCD.12 U4.T18(D:LCD_DATA0)
LCD_D1 [data_lcd]: LCD.11 U4.T19(D:LCD_DATA1)
LCD_D2 [data_lcd]: LCD.10 U4.T20(D:LCD_DATA2)
LCD_D3 [data_lcd]: LCD.9 U4.R18(D:LCD_DATA3)
LCD_D4 [data_lcd]: U4.R19(D:LCD_DATA4)
LCD_D5 [data_lcd]: U4.R20(D:LCD_DATA5)
LCD_D6 [data_lcd]: U4.P18(D:LCD_DATA6)
LCD_D7 [data_lcd]: U4.P19(D:LCD_DATA7)
LCD_D8 [data_lcd]: U4.P20(D:LCD_DATA8)
LCD_D9 [data_lcd]: U4.N18(D:LCD_DATA9)
LCD_DA [data_lcd]: U4.N19(D:LCD_DATA10)
LCD_DB [data_lcd]: U4.N20(D:LCD_DATA11)
LCD_DC [data_lcd]: U4.M18(D:LCD_DATA12)
LCD_DD [data_lcd]: U4.M19(D:LCD_DATA13)
LCD_DE [data_lcd]: U4.M20(D:LCD_DATA14)
LCD_DF [data_lcd]: U4.L18(D:LCD_DATA15)
LCD_HSYNC [data_lcd]: LCD.15 U4.U19(D:LCD_HSYNC)
LCD_PCLK [data_lcd]: LCD.14 U4.U20(D:LCD_PCLK)
LCD_VSYNC [data_lcd]: LCD.7 U4.U18(D:LCD_VSYNC)
MCASP0_ACLKR: U4.Y15(C:MCASP0_ACLKR) ; also sheet 2
MCASP0_ACLKX: U4.Y17(C:MCASP0_ACLKX) ; also sheet 2
MCASP0_AHCLKR: U4.W17(C:MCASP0_AHCLKR)
MCASP0_AHCLKX: U4.V16(C:MCASP0_AHCLKX)
MCASP0_AXR0: U4.W16(C:MCASP0_AXR0) ; also sheet 2
MCASP0_AXR1: U4.V17(C:MCASP0_AXR1) ; also sheet 2
MCASP0_FSR: U4.W15(C:MCASP0_FSR) ; also sheet 2
MCASP0_FSX: U4.Y16(C:MCASP0_FSX) ; also sheet 2
N$35: LCD.6
SD0_CD0: T1.CD1(SHIELD)
SD0_CD1: T1.CD2(SHIELD)
SD0_CLK [data]: T1.5(SCK) U4.W3(C:MMC0_CLK)
SD0_CMD [data]: T1.3(DI) U4.W2(C:MMC0_CMD)
SD0_D0 [data]: T1.7(DO) U4.Y3(C:MMC0_DAT0)
SD0_D1 [data]: T1.8(RSV) U4.V3(C:MMC0_DAT1)
SD0_D2 [data]: T1.1(NC) U4.V2(C:MMC0_DAT2)
SD0_D3 [data]: T1.2(CS) U4.Y2(C:MMC0_DAT3)
SD1_CLK [data]: U4.U1(D:MII1_RXD1) U$1.3(SDIO_CLK)
SD1_CMD [data]: U4.P3(D:MII1_TX_EN) U$1.5(SDIO_CMD)
SD1_D0 [data]: U4.R1(D:MII1_RX_DV) U$1.6(SDIO_D0)
SD1_D1 [data]: U4.P2(D:MII1_TXD3) U$1.8(SDIO_D1)
SD1_D2 [data]: U4.P1(D:MII1_TXD2) U$1.4(SDIO_D2)
SD1_D3 [data]: U4.R2(D:MII1_COL) U$1.7(SDIO_D3)
SPI0_CS0: U4.Y4(C:SPI0_CS0)
SPI0_CS1: U4.V4(C:SPI0_CS1)
SPI0_D0: U4.W5(C:SPI0_D0)
SPI0_D1: U4.W4(C:SPI0_D1)
SPI0_SCLK: U4.Y5(C:SPI0_SCLK)
T_X+: LCD.25
T_X-: LCD.24
T_Y+: LCD.23
T_Y-: LCD.26
UART0_CTS [data_lowspeed]: U4.V6(C:UART0_CTSN)
UART0_RTS [data_lowspeed]: U4.V5(C:UART0_RTSN)
UART0_RXD [data_lowspeed]: U4.Y6(C:UART0_RXD)
UART0_TXD [data_lowspeed]: U4.W6(C:UART0_TXD)
UART1_CTS [data_lowspeed]: U4.W8(C:UART1_CTSN) U$1.18(BT_UART_CTS)
UART1_RTS [data_lowspeed]: U4.Y8(C:UART1_RTSN) U$1.16(BT_UART_RTS)
UART1_RXD [data_lowspeed]: U4.Y7(C:UART1_RXD) U$1.17(BT_UART_TXD)
UART1_TXD [data_lowspeed]: U4.W7(C:UART1_TXD) U$1.19(BT_UART_RXD)
VCC132 [power]: LCD.17 ; also sheet 1
VCC256 [power]: LCD.18 ; also sheet 1
XDMA_EVENT_INTR0: U4.W14(C:XDMA_EVENT_INTR0)
XDMA_EVENT_INTR1: U4.V14(C:XDMA_EVENT_INTR1)
Unconnected: LCD.13 LCD.27 LCD.28 U4.M3(D:RMII1_REF_CLK) U4.N1(D:MII1_TX_CLK) U4.N2(D:MII1_TXD0) U4.N3(D:MII1_TXD1) U4.R3(D:MII1_CRS) U4.T1(D:MII1_RX_CLK) U4.T2(D:MII1_RX_ER) U4.T3(D:MII1_RXD0) U4.U2(D:MII1_RXD2) U4.U3(D:MII1_RXD3) U4.V1(D:MDIO) U4.W1(D:MDC) U$1.1(CLK_32KHZ) U$1.2(GPIO_1) U$1.10(WL_HOST_WAKE) U$1.11(WL_REG_ON) U$1.12(BT_REG_ON) U$1.20(BT_DEV_WAKE) U$1.21(BT_HOST_WAKE)

### Buses
SD0:+3V3,GND,SD0_CD0,SD0_CD1,SD0_CLK,SD0_CMD,SD0_D0,SD0_D1,SD0_D2,SD0_D3
SD1:SD1_CLK,SD1_CMD,SD1_D0,SD1_D1,SD1_D2,SD1_D3
UART1:UART1_CTS,UART1_RTS,UART1_RXD,UART1_TXD
LCD:LCD_AC_BIAS_EN,LCD_HSYNC,LCD_VSYNC,LCD_PCLK,LCD_D0,LCD_D1,LCD_D2,LCD_D3,LCD_D4,LCD_D5,LCD_D6,LCD_D7,LCD_D8,LCD_D9,LCD_DA,LCD_DB,LCD_DC,LCD_DD,LCD_DE,LCD_DF
UART0:UART0_CTS,UART0_RTS,UART0_RXD,UART0_TXD
MCASP0:MCASP0_ACLKR,MCASP0_ACLKX,MCASP0_AHCLKR,MCASP0_AHCLKX,MCASP0_AXR0,MCASP0_AXR1,MCASP0_FSR,MCASP0_FSX
SPI0:SPI0_CS0,SPI0_CS1,SPI0_D0,SPI0_D1,SPI0_SCLK
GPMC:GPMC_A0,GPMC_A1,GPMC_A2,GPMC_A3,GPMC_A4,GPMC_A5,GPMC_A6,GPMC_A7,GPMC_A8,GPMC_A9,GPMC_A10,GPMC_A11,GPMC_AD8,GPMC_AD9,GPMC_AD10,GPMC_AD11,GPMC_AD12,GPMC_AD13,GPMC_AD14,GPMC_AD15,GPMC_ADVN_ALE,GPMC_BEN0_CLE,GPMC_BEN1,GPMC_CLK,GPMC_CSN0,GPMC_CSN3,GPMC_OEN_REN,GPMC_WAIT0,GPMC_WEN,GPMC_WPN
LCD_TOUCH:T_X+,T_Y+,T_X-,T_Y-
LCD_EL:EL_VA,EL_VB,GND
LCD_POWER:+3V3,GND,LCD_BIAS_N,LCD_BIAS_P,VCC33,VCC132,VCC256

### Notes on the sheet
- SD, WiFi, LCD
- PsiOnSD
  (c)Greg "GothAck" Miell 2019
  Licensed under the TAPR Open Hardware License (www.tapr.org/OHL)
- Both grounds must be connected on the PCB at only one point close to the GND pin.

## Sheet 4 of 5
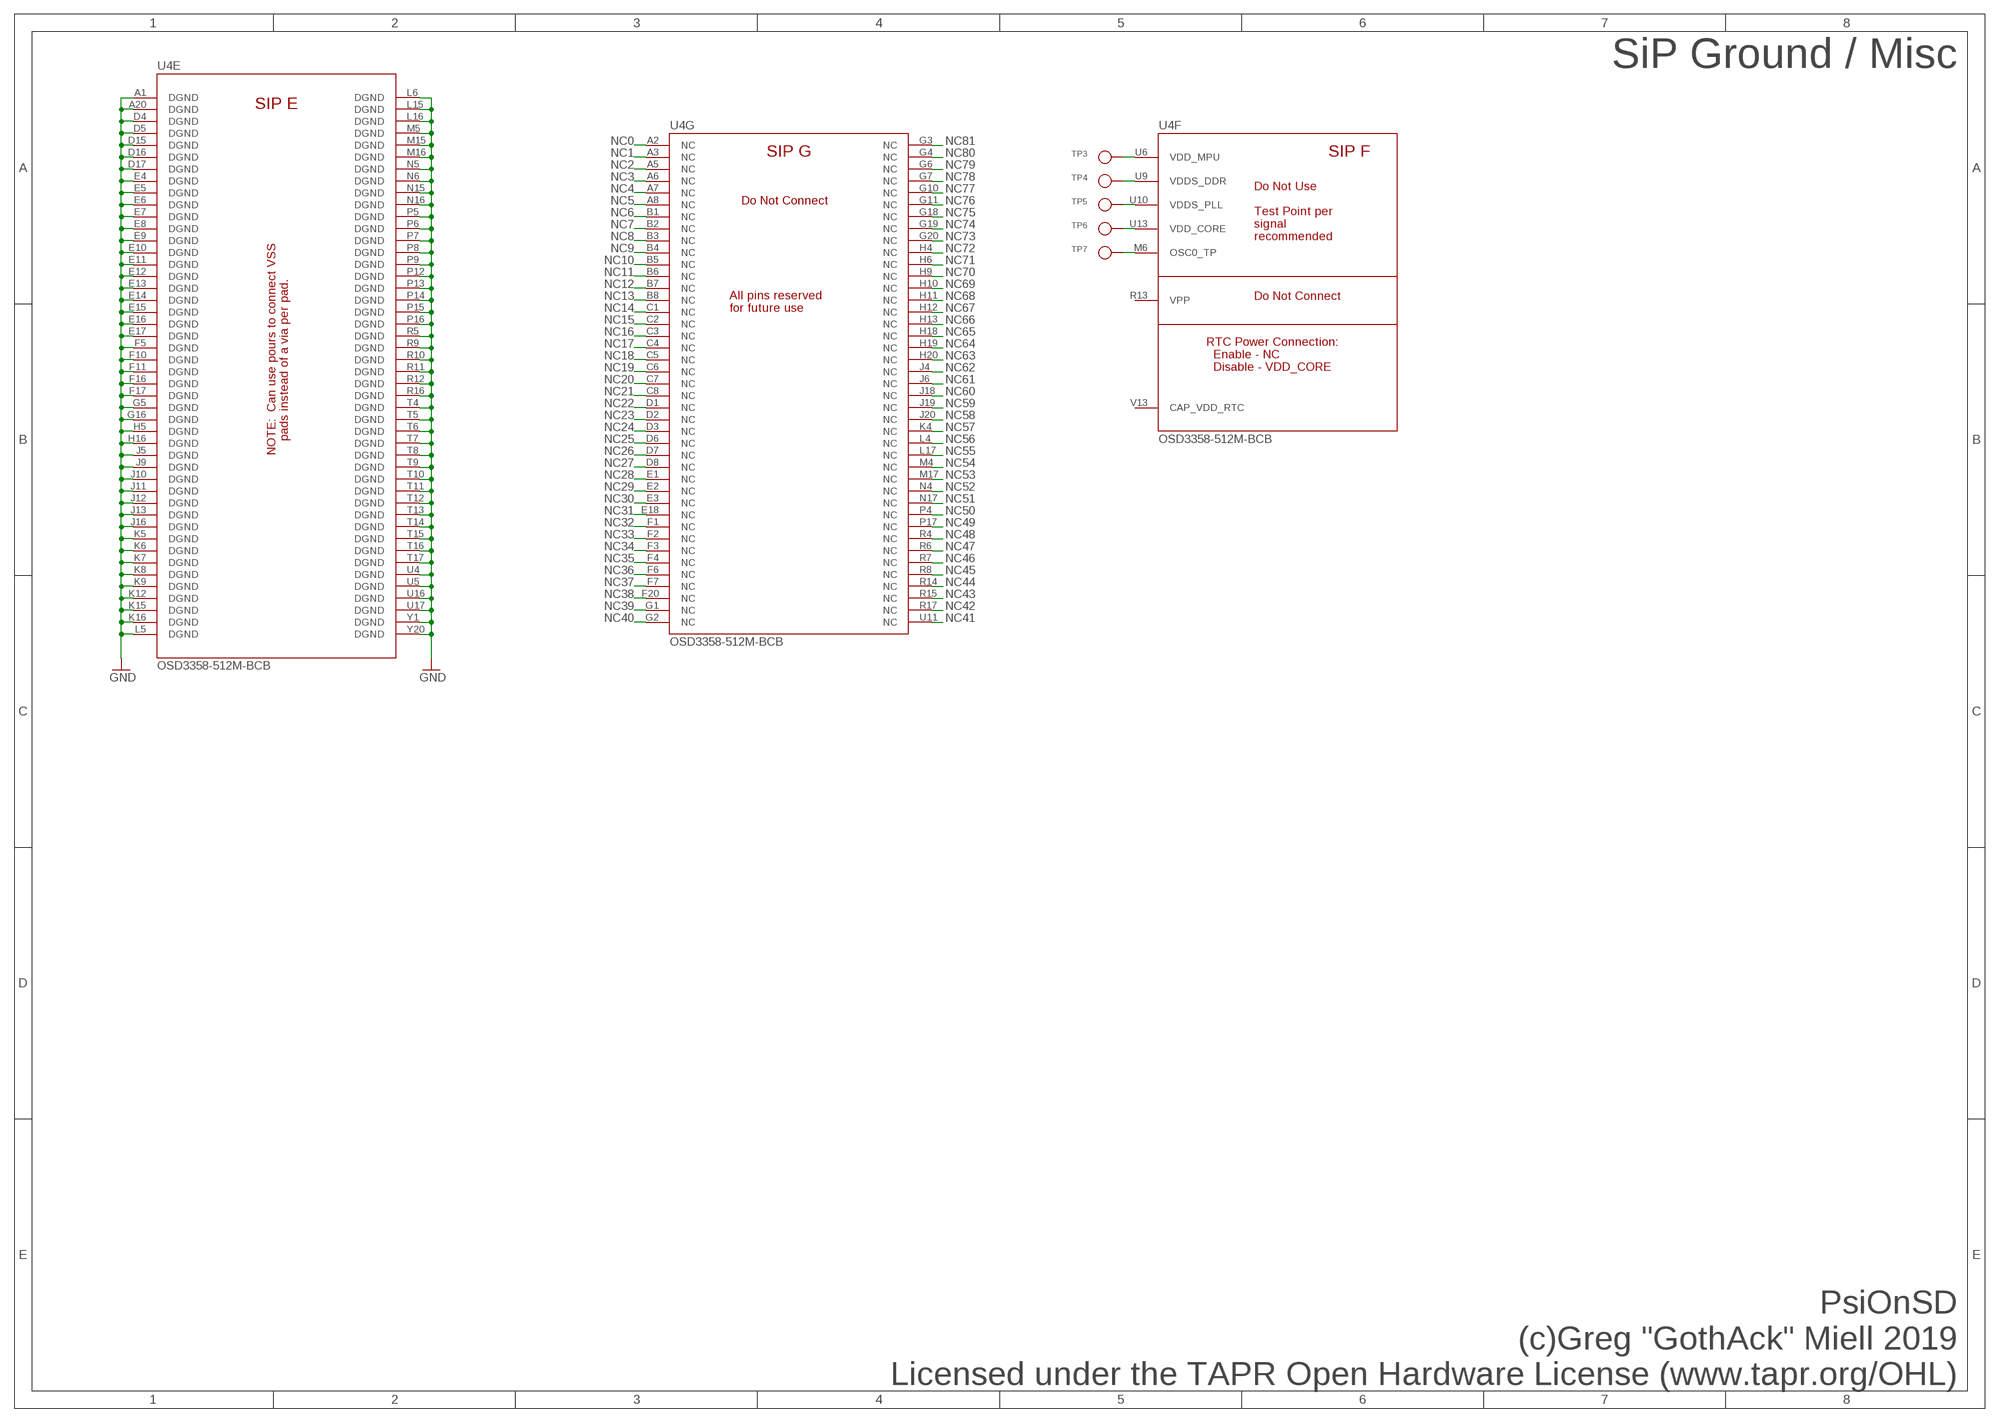
[diagram p4: schematic, sheet 4]

### Parts
TP3  TESTPOINTROUND1MM  [TESTPOINT_ROUND_1MM]
TP4  TESTPOINTROUND1MM  [TESTPOINT_ROUND_1MM]
TP5  TESTPOINTROUND1MM  [TESTPOINT_ROUND_1MM]
TP6  TESTPOINTROUND1MM  [TESTPOINT_ROUND_1MM]
TP7  TESTPOINTROUND1MM  [TESTPOINT_ROUND_1MM]

### Nets
GND [power]: U4.A1(E:DGND) U4.A20(E:DGND) U4.D4(E:DGND) U4.D5(E:DGND) U4.D15(E:DGND) U4.D16(E:DGND) U4.D17(E:DGND) U4.E4(E:DGND) U4.E5(E:DGND) U4.E6(E:DGND) U4.E7(E:DGND) U4.E8(E:DGND) U4.E9(E:DGND) U4.E10(E:DGND) U4.E11(E:DGND) U4.E12(E:DGND) U4.E13(E:DGND) U4.E14(E:DGND) U4.E15(E:DGND) U4.E16(E:DGND) U4.E17(E:DGND) U4.F5(E:DGND) U4.F10(E:DGND) U4.F11(E:DGND) U4.F16(E:DGND) U4.F17(E:DGND) U4.G5(E:DGND) U4.G16(E:DGND) U4.H5(E:DGND) U4.H16(E:DGND) U4.J5(E:DGND) U4.J9(E:DGND) U4.J10(E:DGND) U4.J11(E:DGND) U4.J12(E:DGND) U4.J13(E:DGND) U4.J16(E:DGND) U4.K5(E:DGND) U4.K6(E:DGND) U4.K7(E:DGND) U4.K8(E:DGND) U4.K9(E:DGND) U4.K12(E:DGND) U4.K15(E:DGND) U4.K16(E:DGND) U4.L5(E:DGND) U4.L6(E:DGND) U4.L15(E:DGND) U4.L16(E:DGND) U4.M5(E:DGND) U4.M15(E:DGND) U4.M16(E:DGND) U4.N5(E:DGND) U4.N6(E:DGND) U4.N15(E:DGND) U4.N16(E:DGND) U4.P5(E:DGND) U4.P6(E:DGND) U4.P7(E:DGND) U4.P8(E:DGND) U4.P9(E:DGND) U4.P12(E:DGND) U4.P13(E:DGND) U4.P14(E:DGND) U4.P15(E:DGND) U4.P16(E:DGND) U4.R5(E:DGND) U4.R9(E:DGND) U4.R10(E:DGND) U4.R11(E:DGND) U4.R12(E:DGND) U4.R16(E:DGND) U4.T4(E:DGND) U4.T5(E:DGND) U4.T6(E:DGND) U4.T7(E:DGND) U4.T8(E:DGND) U4.T9(E:DGND) U4.T10(E:DGND) U4.T11(E:DGND) U4.T12(E:DGND) U4.T13(E:DGND) U4.T14(E:DGND) U4.T15(E:DGND) U4.T16(E:DGND) U4.T17(E:DGND) U4.U4(E:DGND) U4.U5(E:DGND) U4.U16(E:DGND) U4.U17(E:DGND) U4.Y1(E:DGND) U4.Y20(E:DGND) ; also sheet 1,2,3
N$2: TP3.P$1 U4.U6(F:VDD_MPU)
N$6: TP4.P$1 U4.U9(F:VDDS_DDR)
N$17: TP5.P$1 U4.U10(F:VDDS_PLL)
N$18: TP6.P$1 U4.U13(F:VDD_CORE)
N$19: TP7.P$1 U4.M6(F:OSC0_TP)
NC0: U4.A2(G:NC)
NC1: U4.A3(G:NC)
NC2: U4.A5(G:NC)
NC3: U4.A6(G:NC)
NC4: U4.A7(G:NC)
NC5: U4.A8(G:NC)
NC6: U4.B1(G:NC)
NC7: U4.B2(G:NC)
NC8: U4.B3(G:NC)
NC9: U4.B4(G:NC)
NC10: U4.B5(G:NC)
NC11: U4.B6(G:NC)
NC12: U4.B7(G:NC)
NC13: U4.B8(G:NC)
NC14: U4.C1(G:NC)
NC15: U4.C2(G:NC)
NC16: U4.C3(G:NC)
NC17: U4.C4(G:NC)
NC18: U4.C5(G:NC)
NC19: U4.C6(G:NC)
NC20: U4.C7(G:NC)
NC21: U4.C8(G:NC)
NC22: U4.D1(G:NC)
NC23: U4.D2(G:NC)
NC24: U4.D3(G:NC)
NC25: U4.D6(G:NC)
NC26: U4.D7(G:NC)
NC27: U4.D8(G:NC)
NC28: U4.E1(G:NC)
NC29: U4.E2(G:NC)
NC30: U4.E3(G:NC)
NC31: U4.E18(G:NC)
NC32: U4.F1(G:NC)
NC33: U4.F2(G:NC)
NC34: U4.F3(G:NC)
NC35: U4.F4(G:NC)
NC36: U4.F6(G:NC)
NC37: U4.F7(G:NC)
NC38: U4.F20(G:NC)
NC39: U4.G1(G:NC)
NC40: U4.G2(G:NC)
NC41: U4.U11(G:NC)
NC42: U4.R17(G:NC)
NC43: U4.R15(G:NC)
NC44: U4.R14(G:NC)
NC45: U4.R8(G:NC)
NC46: U4.R7(G:NC)
NC47: U4.R6(G:NC)
NC48: U4.R4(G:NC)
NC49: U4.P17(G:NC)
NC50: U4.P4(G:NC)
NC51: U4.N17(G:NC)
NC52: U4.N4(G:NC)
NC53: U4.M17(G:NC)
NC54: U4.M4(G:NC)
NC55: U4.L17(G:NC)
NC56: U4.L4(G:NC)
NC57: U4.K4(G:NC)
NC58: U4.J20(G:NC)
NC59: U4.J19(G:NC)
NC60: U4.J18(G:NC)
NC61: U4.J6(G:NC)
NC62: U4.J4(G:NC)
NC63: U4.H20(G:NC)
NC64: U4.H19(G:NC)
NC65: U4.H18(G:NC)
NC66: U4.H13(G:NC)
NC67: U4.H12(G:NC)
NC68: U4.H11(G:NC)
NC69: U4.H10(G:NC)
NC70: U4.H9(G:NC)
NC71: U4.H6(G:NC)
NC72: U4.H4(G:NC)
NC73: U4.G20(G:NC)
NC74: U4.G19(G:NC)
NC75: U4.G18(G:NC)
NC76: U4.G11(G:NC)
NC77: U4.G10(G:NC)
NC78: U4.G7(G:NC)
NC79: U4.G6(G:NC)
NC80: U4.G4(G:NC)
NC81: U4.G3(G:NC)
Unconnected: U4.R13(F:VPP) U4.V13(F:CAP_VDD_RTC)

### Notes on the sheet
- SiP Ground / Misc
- PsiOnSD
  (c)Greg "GothAck" Miell 2019
  Licensed under the TAPR Open Hardware License (www.tapr.org/OHL)

## Sheet 5 of 5
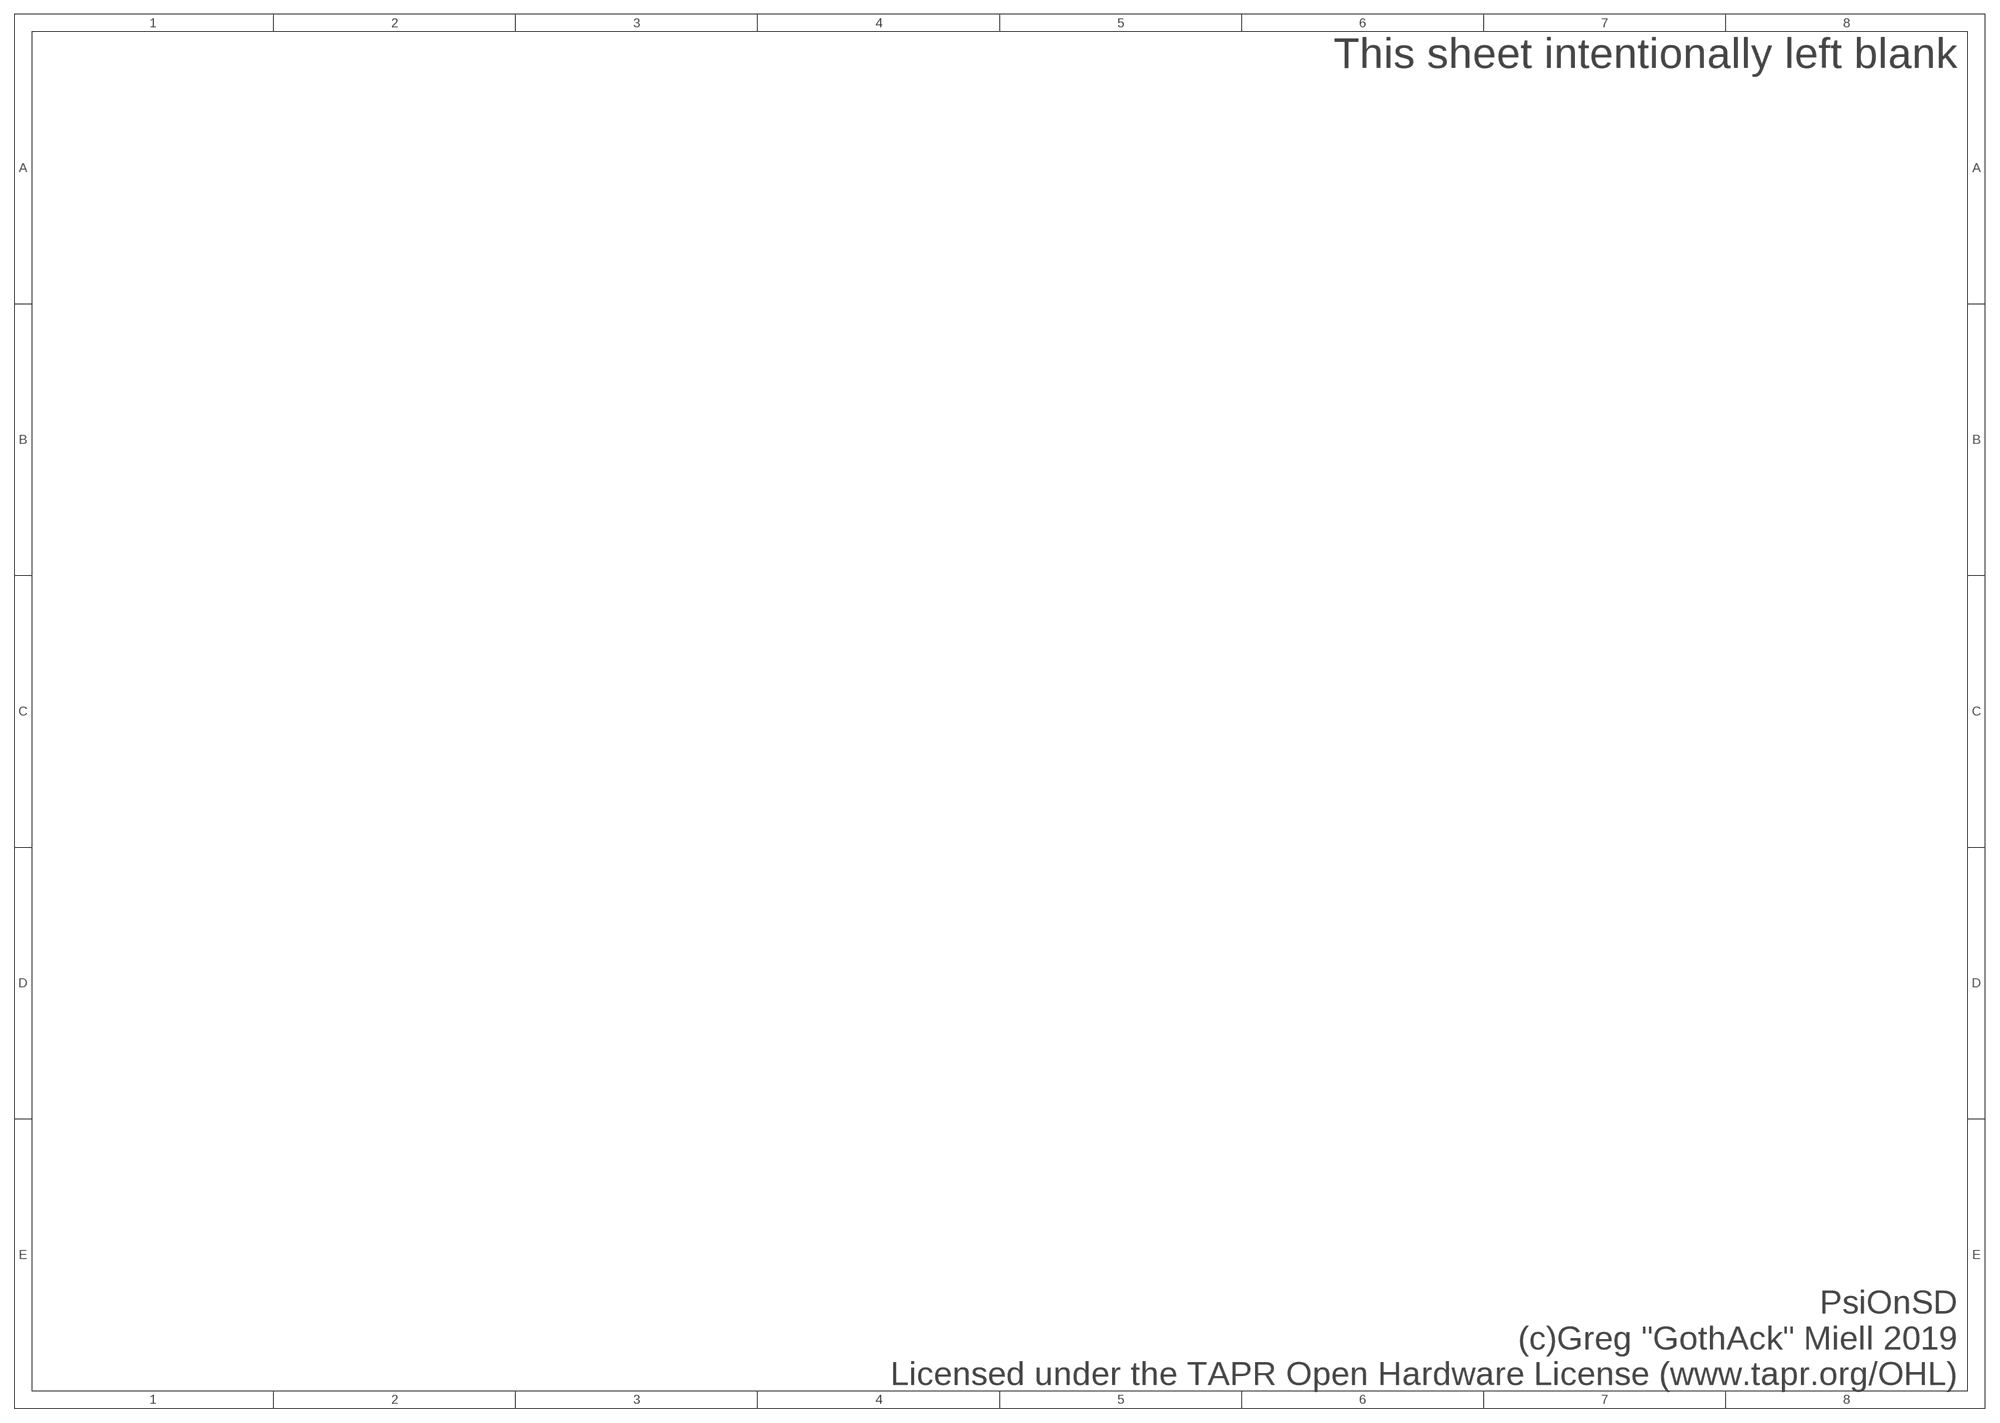
[diagram p5: schematic, sheet 5]

### Notes on the sheet
- This sheet intentionally left blank
- PsiOnSD
  (c)Greg "GothAck" Miell 2019
  Licensed under the TAPR Open Hardware License (www.tapr.org/OHL)

## Power pins joined to a net without a drawn wire
EP: U9.17(EP)
S: J1.S1(S) J1.S2(S)

## Library data of the parts
C1 C2 = adafruit:C-US: CAPACITOR, American symbol
C8-C10 C14-C16 C21-C27 C30 = dp_devices:CAPACITOR_NPOL: Non-Polarized capacitor in various packages
C11 C12 C28 C29 = gothack:CPOL-US: POLARIZED CAPACITOR, American symbol
C17-C19 = microbuilder:CAP_CERAMIC: Ceramic Capacitors 0402 - 0402 Surface Mount Capacitors 16pF 50V 5% [Digikey: 445-4899-2-ND] 18pF 50V 5% [Digikey: 490-1281-2-ND] 22pF 50V 5% [Digikey: 490-1283-2-ND] 68pF 50V 5% [Digikey: 490-1289-2-ND] 0.1uF 10V 10% [Digikey: 490-1318-2-ND] 1.0uF 6.3V 10% [Digikey: 490-1320-2-ND] 0603 - 0603 Surface Mount Capacitors 16 pF 50V 5% [Digikey: 445-5051-2-ND] 22 pF 50V [Digikey: PCC220ACVTR-ND] 33 pF 50V 5% [Digikey: 490-1415-1-ND] 56pF 50V 5% [Digikey: 490-1421-1-ND] 220pF 50V 5% [Digikey: 445-1285-1-ND] 680 pF 50V 2200 pF 50V 5% C0G [Digikey: 445-1297-1-ND] 5600 pF 100V 5% X7R [Digikey: 478-3711-1-ND] 0.1 µF 25V 10% [Digikey: PCC2277TR-ND] 0.22 µF 16V 10% X7R [Digikey: 445-1318-1-ND] 1.0 µF 25V 10% [Digikey: 445-5146-2-ND] 0603 - RF Specific 3pF 250V +/-0.1pF RF [Digikey: 712-1347-1-ND] 18 pF 250V 5% [Digikey: 478-3505-1-ND or 712-1322-1-ND] 56 pF 250V 5% C0G RF [Digikey: 490-4867-1-ND] 68 pF 250V RF [Digikey: 490-4868-1-ND] 0805 - 0805 Surface Mount Capacitors 220 pF 250V 2% RF Ceramic Capacitor [Digikey: 712-1398-1-ND] 1000 pF 50V 2% NP0 Ceramic Capacitor [Digikey: 478-3760-1-ND] 0.1 µF 25V 10% Ceramic Capacitor [Digikey: PCC1828TR-ND] 1.0 µF 16V 10% Ceramic Capacitor[Digikey: 490-1691-2-ND] 10.0 µF 10V 10% Ceramic Capacitor[Digikey: 709-1228-1-ND] 10.0 uF 16V 10% Ceramic Capacitor [Digikey: 478-5165-2-ND] 47 uF 6.3V 20% Ceramic Capacitor [Digikey: 587-1779-1-ND or 399-5506-1-ND] 1206 - 1206 Surface Mount Capacitors 47uF 10V 20% Ceramic Capacitor [Digikey: 490-5528-1-ND or 399-5508-1-ND or 445-6010-1-ND] 100uF 6.3V -20%, +80% Y5V Ceramic Capacitor (Digikey: 490-4512-1-ND, Mouser: 81-GRM31CF50J107ZE1L)
C20 = rcl:C-US: CAPACITOR, American symbol; SPICEPREFIX: C
CN1 = adafruit:JST_2PIN: JST 2-Pin Connectors of various flavors SMT-RA (S2B-PH-SM4) 4UConnector #17311 SMT (B2B-PH-SM4) THM-RA (S2B-PH) THM (B2B-PH)
D1 D4 D5 D8-D11 = ipc-7351-diode:SCHOTTKY_
D7 = ipc-7351-diode:DIODE_
J1 = gothack:0522070433
J2 = gothack:1-2295018-2: SPLASH PROOF USB TYPE C REC, DUAL SMT; Tape/Reel of 900; AVAILABILITY: Unavailable; COMMENT: 1-2295018-2; DESCRIPTION: Conn USB Type C RCP 12 POS Solder RA SMD 12 Terminal 1 Port T/R; MF: TE Connectivity; MP: 1-2295018-2; PACKAGE: None; PRICE: None; TE_PURCHASE_URL: https://www.te.com/usa-en/product-1-2295018-2.html?te_bu=Cor&te_type=disp&te_campaign=seda_glo_cor-seda-global-disp-prtnr-fy19-seda-model-bom-cta_sma-317_1&elqCampaignId=32493
JP1 = SparkFun-Jumpers:JUMPER-SMT_2_NO: Normally open jumper This jumper has two pads in close proximity to each other. Apply solder to close the connection. Round pads are easier to solder for beginners, but are a lot larger. SparkFun Product that uses the round pads: SparkFun EL Sequencer <https://www.sparkfun.com/products/12781>
KBD = 54548-2271:54548-2271: Conn FFC/FPC Connector SKT 22 POS 0.5mm Solder RA SMD Easy-On™ T/R; AVAILABILITY: Unavailable; DESCRIPTION: Conn FFC/FPC Connector SKT 22 POS 0.5mm Solder RA SMD Easy-On™ T/R; MF: Molex; MP: 54548-2271; PACKAGE: None; PRICE: None
L2 L4 L5 = microbuilder:INDUCTOR: Inductors 0603: 10nH Ceramic Inductor - microwire antenna/RF (Digikey: 712-1434-2-ND) 0805: 560nH Ceramic Inductor - RF (Digikey: 553-1047-1-ND) 270nH Ceramic Inductor - Q = 40@250MHz, +-5%, 1 Ohm DC Resistance (Digikey: 535-10506-2-ND) 1007 (2518 Metric) SMT: 10µH 10% 250mOhm 820mA 1007 Inductor (Digikey: 587-2189-1-ND) 22µH 10% 500mOhm 580mA 1007 Inductor (Digikey: 587-2190-1-ND) 47µH 10% 950mOhm 420mA 1007 Inductor (Digikey: 587-2191-1-ND) 47µH 5% 100mOhm 1A 1008 Inductor (Digikey: 732-1816-1-ND) 5.0x5.0mm (Taiyo Yuden NR5040 Series) 6.8µH 20% 2.3A 64mOhm Inductor (Digikey: 587-2374-2-ND) 5.0x5.0mm (TDK VLC5045 Series) 4.7µH 20% 3.3A 34mOhm Inductor (Digikey: 445-6526-1-ND) 6.8µH 20% 2.7A 46mOhm Inductor (Digikey: 445-6527-1-ND) 6.0x6.0mm (TDK VLC6045 Series) 4.7µH 20% 3.8A 27mOhm Inductor (Digikey: 445-6538-2-ND) 6.8µH 20% 3A 41mOhm Inductor (Digikey: 445-6540-1-ND) 6.2µH 30% 2.2A 45mOhm Inductor (Digikey: SRR5028-6R2YCT-ND) - Not TDK VLC6045 but footprint should match 6.0x6.0mm (TDK SLF6045 Series) 6.8uH 30% 2A 33mOhm Inductor (Digikey: 445-4572-1-ND, Mouser: 810-SLF645T6R8N2R0PF)
L3 = gothack:LQH43NN561J03L
LCD = 0545502671:0545502671; AVAILABILITY: Unavailable; DESCRIPTION: Conn FPC Connector SKT 26 POS 0.5mm Solder RA SMD Embossed T/R; MF: Molex; MP: 0545502671; PACKAGE: None; PRICE: None
LED1 LED2 = adafruit:LED: LED OSRAM: - CHIPLED LG R971, LG N971, LY N971, LG Q971, LY Q971, LO R971, LY R971 LH N974, LH R974 LS Q976, LO Q976, LY Q976 LO Q996 - Hyper CHIPLED LW Q18S LB Q993, LB Q99A, LB R99A - SideLED LS A670, LO A670, LY A670, LG A670, LP A670 LB A673, LV A673, LT A673, LW A673 LH A674 LY A675 LS A676, LA A676, LO A676, LY A676, LW A676 LS A679, LY A679, LG A679 - Hyper Micro SIDELED® LS Y876, LA Y876, LO Y876, LY Y876 LT Y87S - SmartLED LW L88C, LW L88S LB L89C, LB L89S, LG L890 LS L89K, LO L89K, LY L89K LS L896, LA L896, LO L896, LY L896 - TOPLED LS T670, LO T670, LY T670, LG T670, LP T670 LSG T670, LSP T670, LSY T670, LOP T670, LYG T670 LG T671, LOG T671, LSG T671 LB T673, LV T673, LT T673, LW T673 LH T674 LS T676, LA T676, LO T676, LY T676, LB T676, LH T676, LSB T676, LW T676 LB T67C, LV T67C, LT T67C, LS T67K, LO T67K, LY T67K, LW E67C LS E67B, LA E67B, LO E67B, LY E67B, LB E67C, LV E67C, LT E67C LW T67C LS T679, LY T679, LG T679 LS T770, LO T770, LY T770, LG T770, LP T770 LB T773, LV T773, LT T773, LW T773 LH T774 LS E675, LA E675, LY E675, LS T675 LS T776, LA T776, LO T776, LY T776, LB T776 LHGB T686 LT T68C, LB T68C - Hyper Mini TOPLED® LB M676 - Mini TOPLED Santana® LG M470 LS M47K, LO M47K, LY M47K Source: http://www.osram.convergy.de/
MK1 = gothack:SPH0645LM4H-B: Mic Mems Digital I2s Omni -26db; AVAILABILITY: Unavailable; DESCRIPTION: Mic Mems Digital I2s Omni -26db; MF: Knowles; MP: SPH0645LM4H-B; PACKAGE: SIP-7 Bourns; PRICE: None
Q2 Q3 = SparkFun-DiscreteSemi:MOSFET-NCHANNEL: Generic NMOS footprint
Q4 Q7 = ipc-7351-transistor:NPN_
Q5 Q6 = ipc-7351-transistor:MOSFET-PCH_
Q8 Q9 = ipc-7351-transistor:PNP_
R1 R2 R9-R14 R26-R30 = resistor:R-EU_: RESISTOR, European symbol
R4 R15-R17 = adafruit:R-US_: RESISTOR, American symbol
R18-R25 = microbuilder:RESISTOR: Resistors 0402 - 0402 Surface Mount Package 22 Ohm 1% 1/16W [Digikey: 311-22.0LRTR-ND] 33 Ohm 5% 1/16W 1.0K 5% 1/16W 1.5K 5% 1/16W 2.0K 1% 1/16W 10.0K 1% 1/16W [Digikey: 311-10.0KLRTR-ND] 10.0K 5% 1/16W [Digikey: RMCF0402JT10K0TR-ND] 12.1K 1% 1/16W [Digikey: 311-22.0LRTR-ND] 100.0K 5% 1/16W 0603 - 0603 Surface Mount Package 0 Ohm 1/10 Watt 1% Resistor 15 Ohm 1/10 Watt 1% Resistor 33 Ohm 1/10 Watt 1% Resistor 49.9 Ohm 1/10 Watt 1% Resistor 100 Ohm 1/10 Watt 1% Resistor 150 Ohm 1/10 Watt 1% Resistor 240 Ohm 1/10 Watt 1% Resistor 390 Ohm 1/10 Watt 1% Resistor 560 Ohm 1/10 Watt 1% Resistor 680 Ohm 1/10 Watt 1% Resistor 750 Ohm 1/10 Watt 1% Resistor 1.0K Ohm 1/10 Watt 1% Resistor 1.5K Ohm 1/10 Watt 1% Resistor 2.0K Ohm 1/10 Watt 1% Resistor 2.2K Ohm 1/10 Watt 1% Resistor 3.3K Ohm 1/10 Watt 1% Resistor 4.7K Ohm 1/10 Watt 1% Resistor 10.0K Ohm 1/10 Watt 1% Resistor 12.0K Ohm 1/10 Watt 1% Resistor 12.1K Ohm 1/10 Watt 1% Resistor 20.0K Ohm 1/10 Watt 1% Resistor 33.0K Ohm 1/10 Watt 1% Resistor 100.0K Ohm 1/10 Watt 1% Resistor 0805 - 0805 Surface Mount Package 0 Ohm 1/8 Watt 1% Resistor 33 Ohm 1/8 Watt 1% Resistor 100 Ohm 1/8 Watt 1% Resistor 150 Ohm 1/8 Watt 1% Resistor 200 Ohm 1/8 Watt 1% Resistor 240 Ohm 1/8 Watt 1% Resistor 330 Ohm 1/8 Watt 1% Resistor 390 Ohm 1/8 Watt 1% Resistor 470 Ohm 1/8 Watt 1% Resistor 1.0K Ohm 1/8 Watt 1% Resistor 1.5K Ohm 1/8 Watt 1% Resistor 2.0K Ohm 1/8 Watt 1% Resistor 4.7K Ohm 1/8 Watt 1% Resistor 5.1K Ohm 1/8 Watt 1% Resistor 5.6K Ohm 1/8 Watt 1% Resistor 10.0K Ohm 1/8 Watt 1% Resistor 22.0K Ohm 1/8 Watt 1% Resistor 33.0K Ohm 1/8 Watt 1% Resistor 100K Ohm 1/8 Watt 1% Resistor 1206 - 1206 Surface Mount Package 2012 - 2010 Surface Mount Package 0.11 Ohm 1/2 Watt 1% Resistor - Digikey: RHM.11UCT-ND
SW1 = gothack:KSM1131
SW2-SW4 = gothack:LS12T2-T
T1 = con-3m:2908-: 3M Card Connector microSD Normal Polarisation, Push-Push, Surface-Mount, 2900 Series 2908-05WB-MG: Surface mount, right angle Supplier: DigiKey 3M5607CT-ND Source: http://solutions.3m.com/wps/portal/3M/en_US/FP/FireProtection/Products/ProductCatalog/?PC_7_RJH9U5230GE3E02LECFTDQ0R92_nid=GGFDLLB87CbeGKZPW31NMHgl
TP1-TP7 = microbuilder:TESTPOINT: Test Point Various test points for characterisation and PCB testing TESTPOINT_SMT - Compact Surface Mount Test Point [Digikey: 5016KTR-ND]
U1 = USB2514BI-AEZG:USB2514BI-AEZG: USB2514 Series 3 - 3.6 V Quad Port USB 2.0 Hi-Speed Hub Controller - VQFN-36; AVAILABILITY: Unavailable; DESCRIPTION: USB2514 Series 3 - 3.6 V Quad Port USB 2.0 Hi-Speed Hub Controller - VQFN-36; MF: Microchip; MP: USB2514BI-AEZG; PACKAGE: QFN-36 Microchip; PRICE: None
U2 = HV823LG-G:HV823LG-G: None; AVAILABILITY: Unavailable; DESCRIPTION: Driver; EL lamp driver; 160÷200V; Channels: 1; Outputs: 2; SO8; MF: Microchip; MP: HV823LG-G; PACKAGE: SOIC-8 Microchip; PRICE: None
U3 = ATMEGA32U4-AU:ATMEGA32U4-AU: 8-bit Microcontroller with ISP Flash and USB Controller; AVAILABILITY: Unavailable; DESCRIPTION: MCU 8-bit ATmega AVR RISC 32KB Flash 3.3V/5V 44-Pin TQFP; MF: Microchip; MP: ATMEGA32U4-AU; PACKAGE: TQFP-44 Microchip; PRICE: None
U4 = OSD3358-512M-BCB:OSD3358-512M-BCB: Octavo Systems LLC OSD335x Family SiP: 27mm x 27mm, 1.27mm pitch 400 pin BGA contains AM3358, 512MB DDR3, TPS65217, TL5209, 4KB EEPROM, 4GB eMMC, 24MHz oscillator, and passives. Commerical Temperature (case): 0C to 85C.; AVAILABILITY: Unavailable; DESCRIPTION: AM3358 512MB DDR3L 4KB EEPROM TP; MF: Octavo Systems LLC; MP: OSD3358-512M-BCB; PACKAGE: Octavo Systems LLC; PRICE: None
U5 U6 = MAX1620EEE_:MAX1620EEE+: None; AVAILABILITY: Unavailable; DESCRIPTION: Digitally Adjustable LCD Bias Supplies 16-Pin QSOP; MF: Maxim Integrated; MP: MAX1620EEE+; PACKAGE: QSOP-16 Maxim Integrated; PRICE: None
U7 = ATTINY404-SSN:ATTINY404-SSN: None; AVAILABILITY: Unavailable; DESCRIPTION: 20MHZ 4KB SOIC14 IND 105C GREEN; MF: Microchip Technology; MP: ATTINY404-SSN; PACKAGE: SOIC-14 Microchip Technology; PRICE: None
U8 = microbuilder:VREG_TPS6103X: TPS6103x 4A Boost - 1.8-5.5V Input, Adjustable Output to 5.5V
U9 = MAX98357AETE_:MAX98357AETE+: Audio Amp Speaker 1-CH Mono Class-D 16-Pin TQFN EP; AVAILABILITY: Unavailable; DESCRIPTION: Audio Amp Speaker 1-CH Mono Class-D 16-Pin TQFN EP; MF: Maxim Integrated; MP: MAX98357AETE+; PACKAGE: TQFN-16 Maxim; PRICE: None
U$1 = gothack:LM832
U$2 U$6 = TLV70233PDBVR:TLV70233PDBVR: Texas Instruments IC Reg LDO 3.3V 300MA Voltage regulator: 2 - 5.5 in 3.3 V out; AVAILABILITY: Unavailable; DESCRIPTION: Fixed LDO Voltage Regulator, 2V to 5.5V, 260mV Dropout, 3.3Vout, 300mAout, SOT-23-5; MF: Texas Instruments; MP: TLV70233PDBVR; PACKAGE: SOT-23-5 Texas Instruments; PRICE: None; SPICEPREFIX: X
U$3 = gothack:1.27MM-ICSP
U$4 = USB-C:TUSB320: TUSB320 USB Type-C Configuration Channel Logic and Port Control
Y1 Y2 = ABM10-16.000MHZ-D30-T3:ABM10-16.000MHZ-D30-T3: Crystal 12.00mhz 8pf Low Esr Smd; AVAILABILITY: Unavailable; DESCRIPTION: Crystal 16MHz ±20ppm _Tol_ ±30ppm _Stability_ 10pF FUND 150Ohm 4-Pin Mini-CSMD T/R; MF: Abracon; MP: ABM10-16.000MHZ-D30-T3; PACKAGE: SMD-4 Abracon; PRICE: None

## Net classes
0 default: width 0.152 mm, drill 0.254 mm, clearance 0.089 mm
1 data: width 0.152 mm, drill 0.254 mm, clearance 0.089 mm
2 power: width 0.254 mm, drill 0.254 mm, clearance 0.152 mm
3 data_usb: width 0.127 mm, drill 0.254 mm, clearance 0.089 mm
4 data_lcd: width 0.152 mm, drill 0.254 mm, clearance 0.089 mm
5 data_lowspeed: width 0.152 mm, drill 0.254 mm, clearance 0.089 mm